# EAGLE design Tractive System Board Rev7 Test (EAGLE 9.6.2)

## Sheet 1 of 3
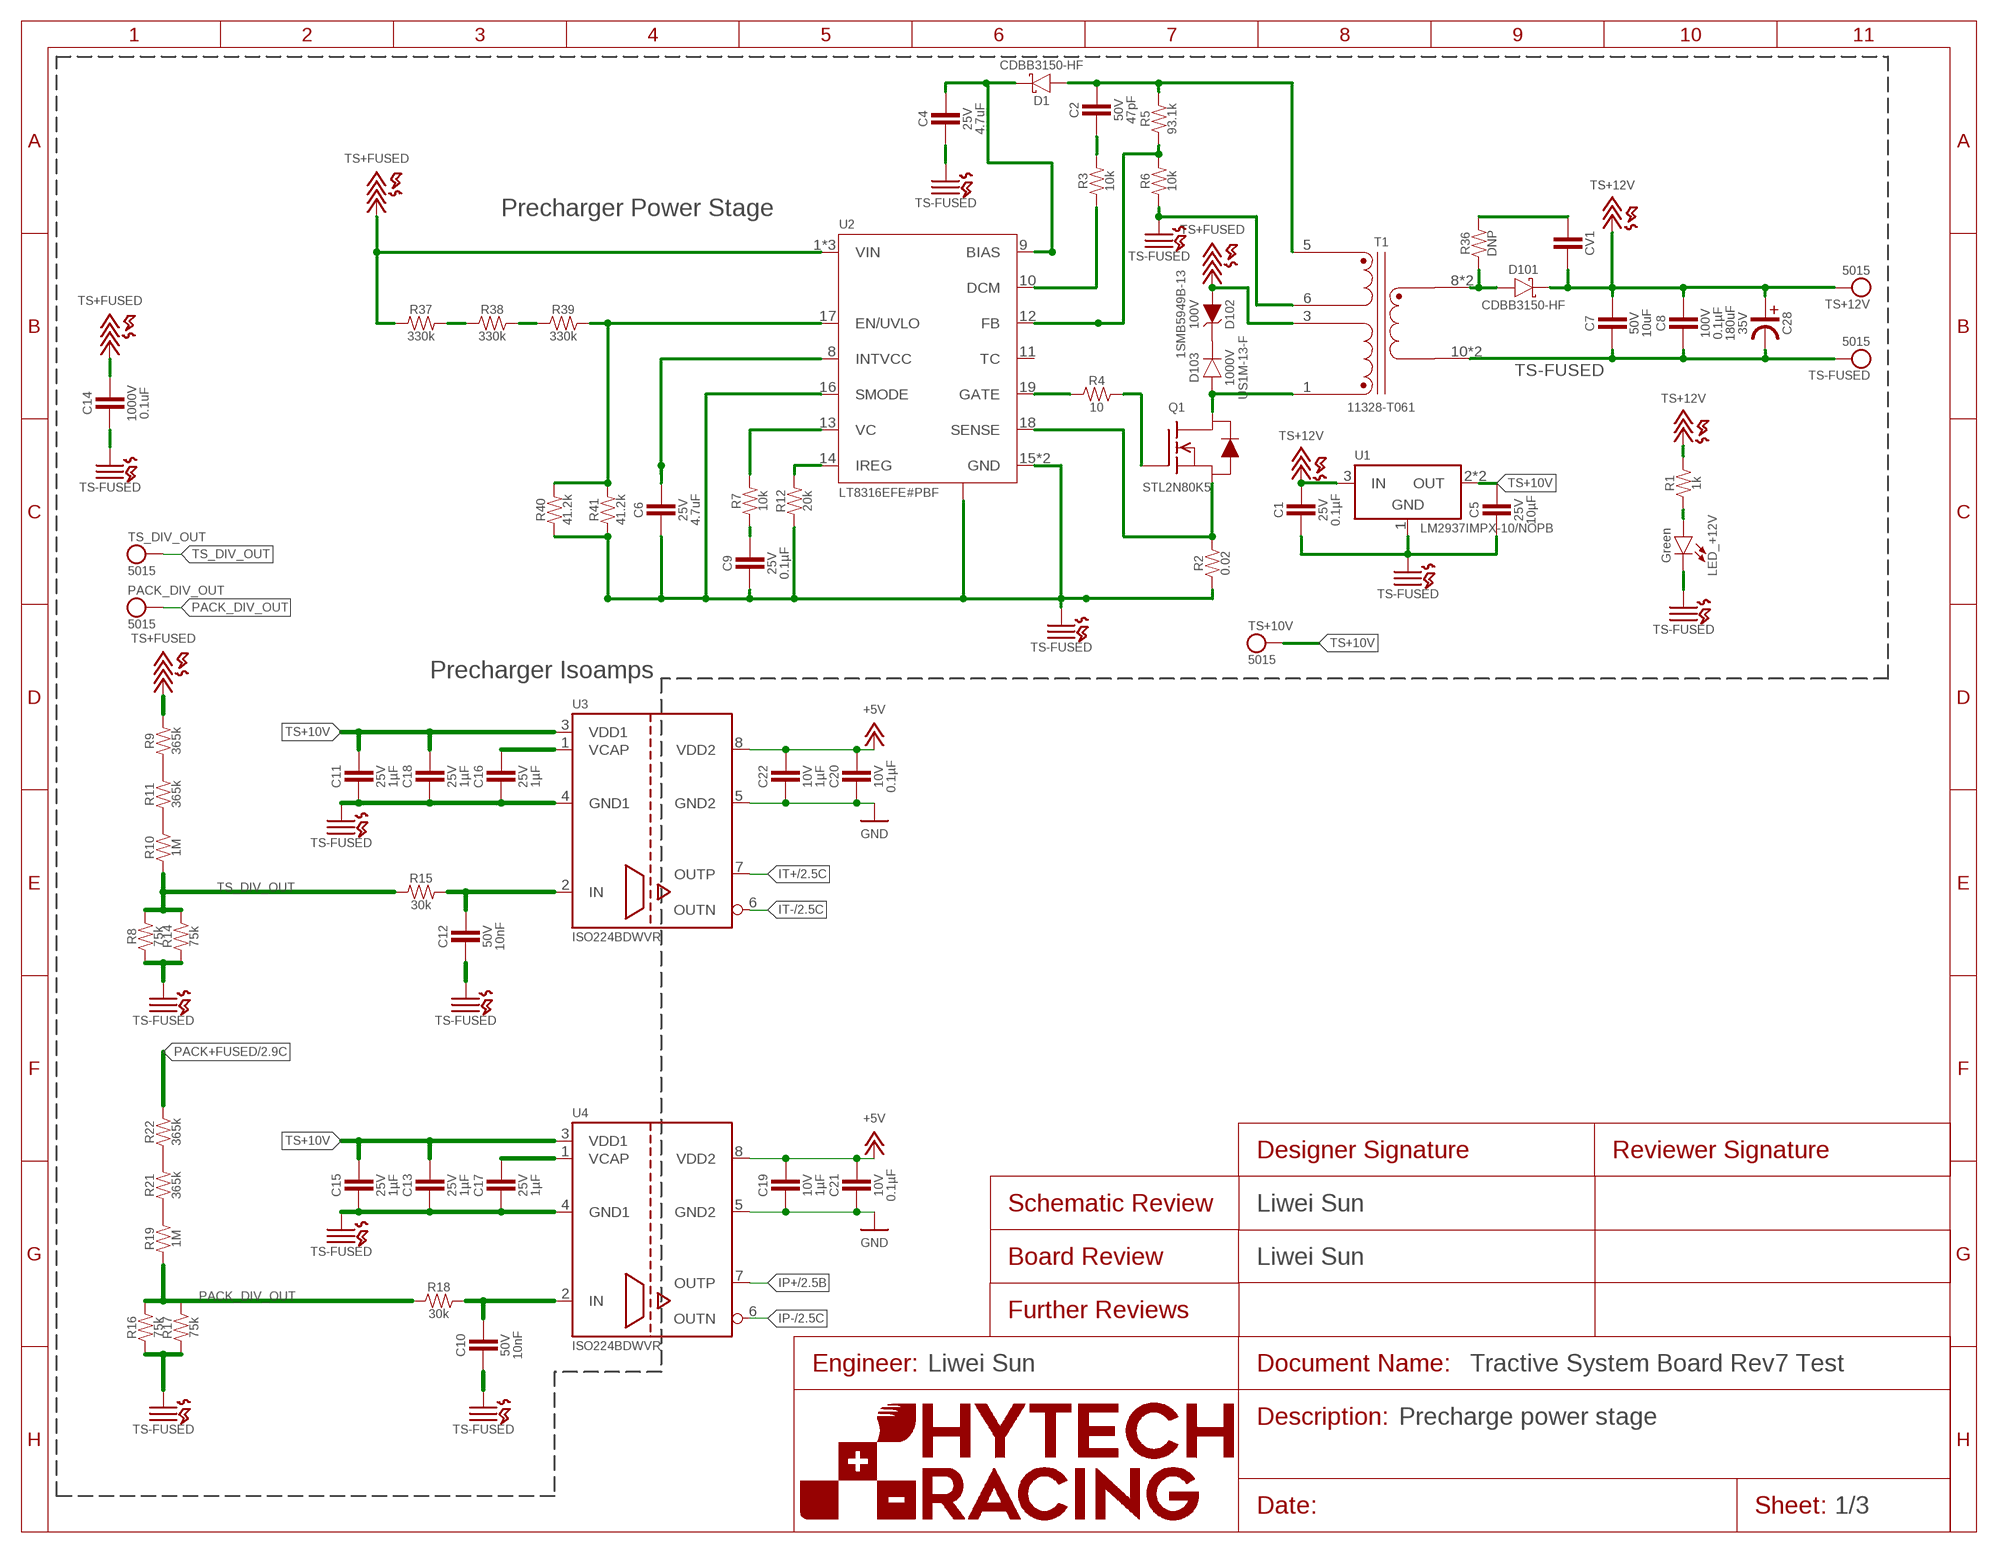
[diagram p0: schematic, sheet 1]
FRAME5 (FRAME): DESCRIPTION_1: Precharge power stage; DESIGNER_BOARD: Liwei Sun; DESIGNER_SCHEMATIC: Liwei Sun; ENGINEER: Liwei Sun

### Parts
C1  CAPACITOR_0603_25V_0.1UF  [0603-CAP]
C2  CAPACITOR_0603_50V_47PF  [0603-CAP]
C4  CAPACITOR_0603_25V_4.7UF  [0603-CAP]
C5  CAPACITOR_0603_25V_10UF  [0603-CAP]
C6  CAPACITOR_0603_25V_4.7UF  [0603-CAP]
C7  CAPACITOR_0805_50V_10UF  [0805-CAP]
C8  CAPACITOR_0603_100V_0.1UF  [0603-CAP]
C9  CAPACITOR_0603_25V_0.1UF  [0603-CAP]
C10  CAPACITOR_0603_50V_10NF  [0603-CAP]
C11  CAPACITOR_0603_25V_1UF  [0603-CAP]
C12  CAPACITOR_0603_50V_10NF  [0603-CAP]
C13  CAPACITOR_0603_25V_1UF  [0603-CAP]
C14  CAPACITOR_1812_1000V_0.1UF  [1812-CAP]
C15  CAPACITOR_0603_25V_1UF  [0603-CAP]
C16  CAPACITOR_0603_25V_1UF  [0603-CAP]
C17  CAPACITOR_0603_25V_1UF  [0603-CAP]
C18  CAPACITOR_0603_25V_1UF  [0603-CAP]
C19  CAPACITOR_0603_10V_1UF  [0603-CAP]
C20  CAPACITOR_0603_10V_0.1UF  [0603-CAP]
C21  CAPACITOR_0603_10V_0.1UF  [0603-CAP]
C22  CAPACITOR_0603_10V_1UF  [0603-CAP]
C28  CAPACITOR_ELECTROLYTIC_A759KR_180UF  [A759KR]
CV1  CAPACITOR_VALUE  [0603-CAP]
D1  SCHOTTKY_DO-214AA_150V  [DO-214AA]
D101  SCHOTTKY_DO-214AA_150V  [DO-214AA]
D102  ZENER_DO-214AA_100V  [DO-214AA]
D103  RECTIFIER_1000V_SMA  [SMA]
LED_+12V  LED_0603_GREEN  [0603-LED]
PACK_DIV_OUT  TEST_POINT  [5015]
Q1  TRANSISTOR_N_MOS_POWERFLAT5X6_STL2N80K5  [POWERFLAT5X6]
R1  RESISTOR_0603_1K  [0603-RES]
R2  RESISTOR_0603_0.02  [0603-RES]
R3  RESISTOR_0603_10K  [0603-RES]
R4  RESISTOR_0603_10  [0603-RES]
R5  RESISTOR_0603_93.1K  [0603-RES]
R6  RESISTOR_0603_10K  [0603-RES]
R7  RESISTOR_0603_10K  [0603-RES]
R8  RESISTOR_0805_HV75K  [0805-RES]
R9  RESISTOR_0805_HV365K  [0805-RES]
R10  RESISTOR_0805_HV1M  [0805-RES]
R11  RESISTOR_0805_HV365K  [0805-RES]
R12  RESISTOR_0603_20K  [0603-RES]
R14  RESISTOR_0805_HV75K  [0805-RES]
R15  RESISTOR_0603_  RESISTOR_0603_30K  [0603-RES]
R16  RESISTOR_0805_HV75K  [0805-RES]
R17  RESISTOR_0805_HV75K  [0805-RES]
R18  RESISTOR_0603_  RESISTOR_0603_30K  [0603-RES]
R19  RESISTOR_0805_HV1M  [0805-RES]
R21  RESISTOR_0805_HV365K  [0805-RES]
R22  RESISTOR_0805_HV365K  [0805-RES]
R36  RESISTOR_0603_DNP  [0603-RES]
R37  RESISTOR_0805_HV330K  [0805-RES]
R38  RESISTOR_0805_HV330K  [0805-RES]
R39  RESISTOR_0805_HV330K  [0805-RES]
R40  RESISTOR_0603_41.2K  [0603-RES]
R41  RESISTOR_0603_41.2K  [0603-RES]
T1  TRANSFORMER(3W)  [PQ2620]
TS+10V  TEST_POINT  [5015]
TS+12V  TEST_POINT  [5015]
TS-FUSED  TEST_POINT  [5015]
TS_DIV_OUT  TEST_POINT  [5015]
U1  VOLTAGE_REGULATOR_SOT-223_10V  [SOT-223]
U2  LT8316  [TSSOP-20(16)]
U3  ISO224B_AIRGAP  [SOIC-08(WIDE,0.295")-AIRGAP]
U4  ISO224B_AIRGAP  [SOIC-08(WIDE,0.295")-AIRGAP]

### Nets
+5V: C19.1 C20.1 C21.1 C22.1 U3.8(VDD2) U4.8(VDD2) ; also sheet 2
GND: C19.2 C20.2 C21.2 C22.2 U3.5(GND2) U4.5(GND2) ; also sheet 2
IP+: U4.7(OUTP) ; also sheet 2
IP-: U4.6(OUTN) ; also sheet 2
IT+: U3.7(OUTP) ; also sheet 2
IT-: U3.6(OUTN) ; also sheet 2
N$1: R21.2 R22.1
N$4: R9.1 R11.2
N$5: D102.2(C) D103.C
N$6: R10.2 R11.1
N$7: R19.2 R21.1
N$8: D103.A Q1.D T1.1
N$9: C4.1 D1.2(C) U2.9(BIAS)
N$12: R5.1 R6.2 U2.12(FB)
N$13: C2.2 R3.2
N$14: R3.1 U2.10(DCM)
N$15: R7.2 U2.13(VC)
N$16: R12.2 U2.14(IREG)
N$17: C2.1 D1.1(A) R5.2 T1.5
N$18: C9.1 R7.1
N$19: C6.1 U2.8(INTVCC)
N$20: R4.1 U2.19(GATE)
N$21: D101.1(A) R36.1 T1.8(8,9) T1.9(8,9)
N$23: LED_+12V.2(A) R1.1
N$26: Q1.S R2.2 U2.18(SENSE)
N$27: Q1.G R4.2
N$28: CV1.2 R36.2
N$29: R37.2 R38.1
N$31: R38.2 R39.1
N$32: R39.2 R40.2 R41.2 U2.17(EN/UVLO)
N$62: C10.1 R18.2 U4.2(IN)
N$63: C12.1 R15.2 U3.2(IN)
N$69: C17.1 U4.1(VCAP)
N$73: C16.1 U3.1(VCAP)
PACK+FUSED: R22.2 ; also sheet 2
PACK_DIV_OUT: PACK_DIV_OUT.1 R16.2 R17.2 R18.1 R19.1
TS+10V: C5.1 C11.1 C13.1 C15.1 C18.1 TS+10V.1 U1.2(OUT) U1.4(OUT) U3.3(VDD1) U4.3(VDD1)
TS+12V: C1.1 C7.1 C8.1 C28.PLUS CV1.1 D101.2(C) R1.2 TS+12V.1 U1.3(IN) ; also sheet 2
TS+FUSED: C14.1 D102.1(A) R9.2 R37.1 T1.3 U2.1(VIN) U2.2(VIN) U2.3(VIN) ; also sheet 2
TS-FUSED: C1.2 C4.2 C5.2 C6.2 C7.2 C8.2 C9.2 C10.2 C11.2 C12.2 C13.2 C14.2 C15.2 C16.2 C17.2 C18.2 C28.MINUS LED_+12V.1(C) R2.1 R6.1 R8.1 R12.1 R14.1 R16.1 R17.1 R40.1 R41.1 T1.6 T1.10(10,11) T1.11(10,11) TS-FUSED.1 U1.1(GND) U2.15(GND) U2.16(SMODE) U2.20(GND) U2.THERMAL U3.4(GND1) U4.4(GND1) ; also sheet 2
TS_DIV_OUT: R8.2 R10.1 R14.2 R15.1 TS_DIV_OUT.1
Unconnected: U2.11(TC)

### Notes on the sheet
- Precharger Power Stage
- Precharger Isoamps

## Sheet 2 of 3
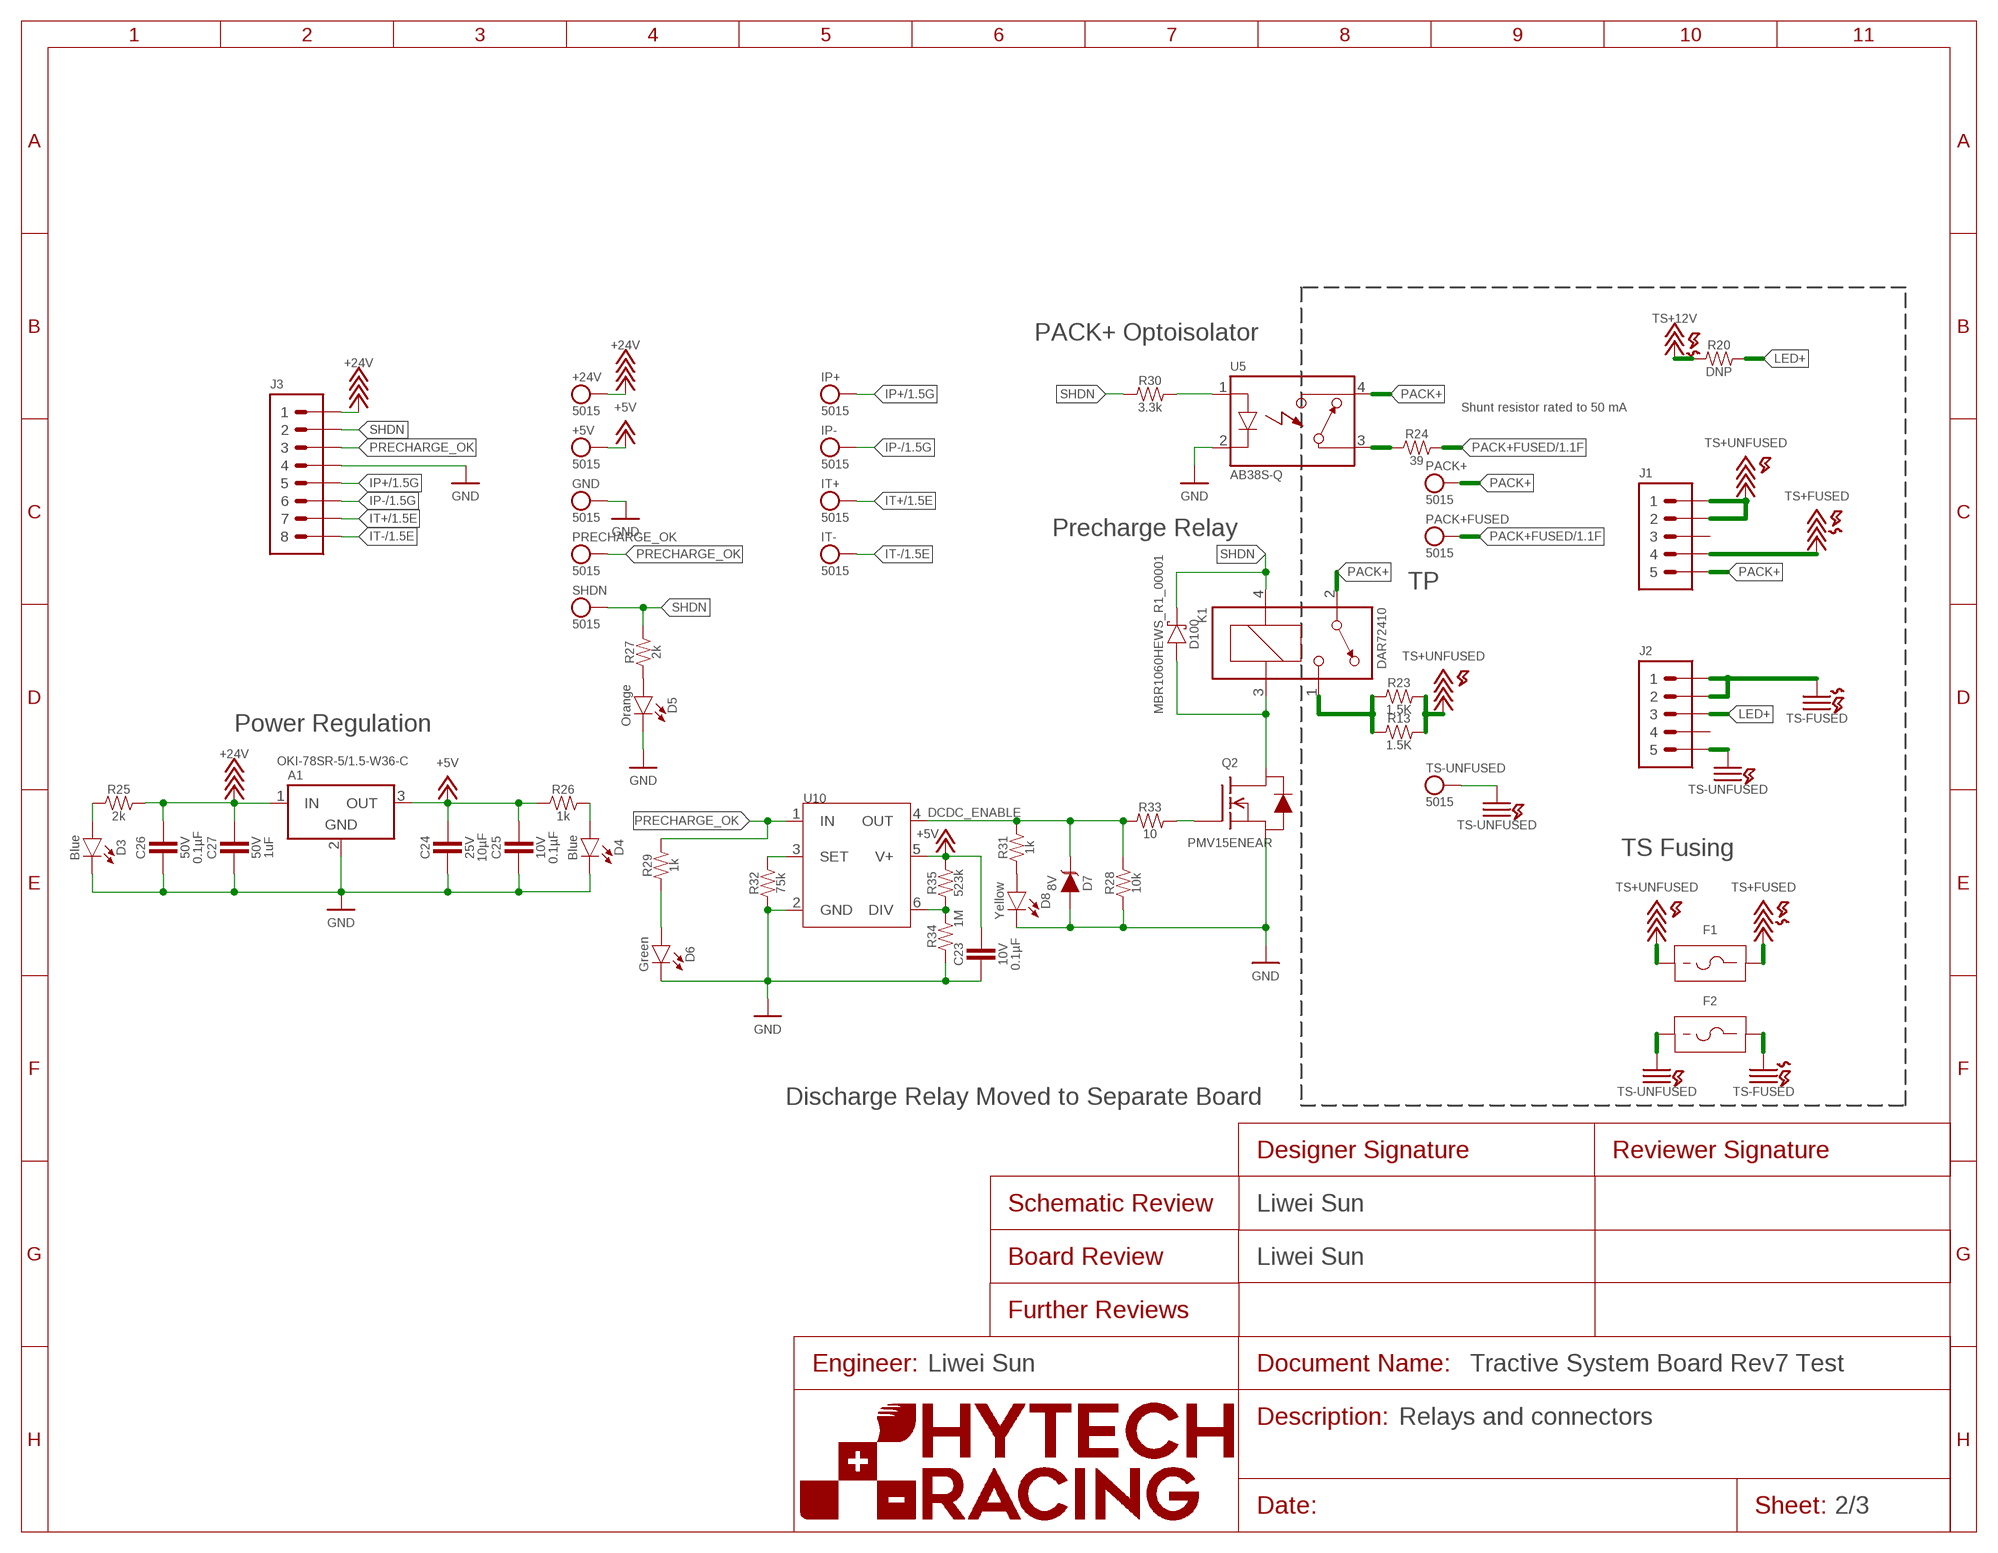
[diagram p1: schematic, sheet 2]
FRAME4 (FRAME): DESCRIPTION_1: Relays and connectors; DESIGNER_BOARD: Liwei Sun; DESIGNER_SCHEMATIC: Liwei Sun; ENGINEER: Liwei Sun

### Parts
+5V  TEST_POINT  [5015]
+24V  TEST_POINT  [5015]
A1  VOLTAGE_REGULATOR_MODULE_OKI-78SR_5V  [OKI-78SR]
C23  CAPACITOR_0603_10V_0.1UF  [0603-CAP]
C24  CAPACITOR_0603_25V_10UF  [0603-CAP]
C25  CAPACITOR_0603_10V_0.1UF  [0603-CAP]
C26  CAPACITOR_0603_50V_0.1UF  [0603-CAP]
C27  CAPACITOR_0603_50V_1UF  [0603-CAP]
D3  LED_0603_BLUE  [0603-LED]
D4  LED_0603_BLUE  [0603-LED]
D5  LED_0603_ORANGE  [0603-LED]
D6  LED_0603_GREEN  [0603-LED]
D7  TVS__8V  [SOT-23]
D8  LED_0603_YELLOW  [0603-LED]
D100  SCHOTTKY_SOD323_60V  [SOD-323]
F1  FUSE_HOLDER_122  [122]
F2  FUSE_HOLDER_122  [122]
GND  TEST_POINT  [5015]
IP+  TEST_POINT  [5015]
IP-  TEST_POINT  [5015]
IT+  TEST_POINT  [5015]
IT-  TEST_POINT  [5015]
J1  CONNECTOR-5_MICRO_V7S_  [MOLEX_MICROFIT_PTH_VERTICAL_07_SINGLE_SPACED]
J2  CONNECTOR-5_MICRO_V6S_  [MOLEX_MICROFIT_PTH_VERTICAL_06_SINGLE_SPACED]
J3  CONNECTOR-8_μF_T_V_BLACK  [MOLEX_MICROFIT_PTH_VERTICAL_08_DUAL]
K1  RELAY_SPST_NO_D_24  [D]
PACK+  TEST_POINT  [5015]
PACK+FUSED  TEST_POINT  [5015]
PRECHARGE_OK  TEST_POINT  [5015]
Q2  TRANSISTOR_N_MOS__PMV15ENEA  [SOT-23]
R13  RESISTOR_B20-SHORTENED_1.5K  [B20-SHORTENED]
R20  RESISTOR_0603_DNP  [0603-RES]
R23  RESISTOR_B20-SHORTENED_1.5K  [B20-SHORTENED]
R24  RESISTOR_0603_39  [0603-RES]
R25  RESISTOR_0603_2K  [0603-RES]
R26  RESISTOR_0603_1K  [0603-RES]
R27  RESISTOR_0603_2K  [0603-RES]
R28  RESISTOR_0603_10K  [0603-RES]
R29  RESISTOR_0603_1K  [0603-RES]
R30  RESISTOR_0603_3.3K  [0603-RES]
R31  RESISTOR_0603_1K  [0603-RES]
R32  RESISTOR_0603_75K  [0603-RES]
R33  RESISTOR_0603_10  [0603-RES]
R34  RESISTOR_0805_1M  [0805-RES]
R35  RESISTOR_0805_523K  [0805-RES]
SHDN  TEST_POINT  [5015]
TS-UNFUSED  TEST_POINT  [5015]
U5  RELAY_SOLIDSTATE_NO_AB38S-Q-AIRGAP  [SOP-04-AIRGAP]
U10  LTC6994-2  [SOT-23-6]

### Nets
+5V: +5V.1 A1.3(OUT) C23.1 C24.1 C25.1 R26.1 R35.2 U10.5(V+) ; also sheet 1
+24V: +24V.1 A1.1(IN) C26.1 C27.1 J3.1 R25.2
DCDC_ENABLE: D7.3(C) R28.2 R31.2 R33.1 U10.4(OUT)
GND: A1.2(GND) C23.2 C24.2 C25.2 C26.2 C27.2 D3.1(C) D4.1(C) D5.1(C) D6.1(C) D7.1(A) D8.1(C) GND.1 J3.4 Q2.2(S) R28.1 R32.1 R34.1 U5.2(CONTROL-) U10.2(GND) ; also sheet 1
IP+: IP+.1 J3.5 ; also sheet 1
IP-: IP-.1 J3.6 ; also sheet 1
IT+: IT+.1 J3.7 ; also sheet 1
IT-: IT-.1 J3.8 ; also sheet 1
LED+: J2.3 R20.2
N$2: D5.2(A) R27.1
N$3: Q2.1(G) R33.2
N$10: R32.2 U10.3(SET)
N$11: R34.2 R35.1 U10.6(DIV)
N$22: D6.2(A) R29.1
N$24: D8.2(A) R31.1
N$25: D3.2(A) R25.1
N$30: D4.2(A) R26.2
N$40: D100.A K1.3(COIL-) Q2.3(D)
N$50: K1.1(CONTACT2) R13.1 R23.1
N$53: R30.2 U5.1(CONTROL+)
N$57: R24.1 U5.3(CONTACT1)
PACK+: J1.5 K1.2(CONTACT1) PACK+.1 U5.4(CONTACT2)
PACK+FUSED: PACK+FUSED.1 R24.2 ; also sheet 1
PRECHARGE_OK: J3.3 PRECHARGE_OK.1 R29.2 U10.1(IN)
SHDN: D100.C J3.2 K1.4(COIL+) R27.2 R30.1 SHDN.1
TS+12V: R20.1 ; also sheet 1
TS+FUSED: F1.3 F1.4 J1.4 ; also sheet 1
TS+UNFUSED: F1.1 F1.2 J1.1 J1.2 R13.2 R23.2
TS-FUSED: F2.3 F2.4 J2.1 J2.2 ; also sheet 1
TS-UNFUSED: F2.1 F2.2 J2.5 TS-UNFUSED.1
Unconnected: J1.3 J2.4

### Notes on the sheet
- PACK+ Optoisolator
- Shunt resistor rated to 50 mA
- Precharge Relay
- TP
- Power Regulation
- TS Fusing
- Discharge Relay Moved to Separate Board

## Sheet 3 of 3
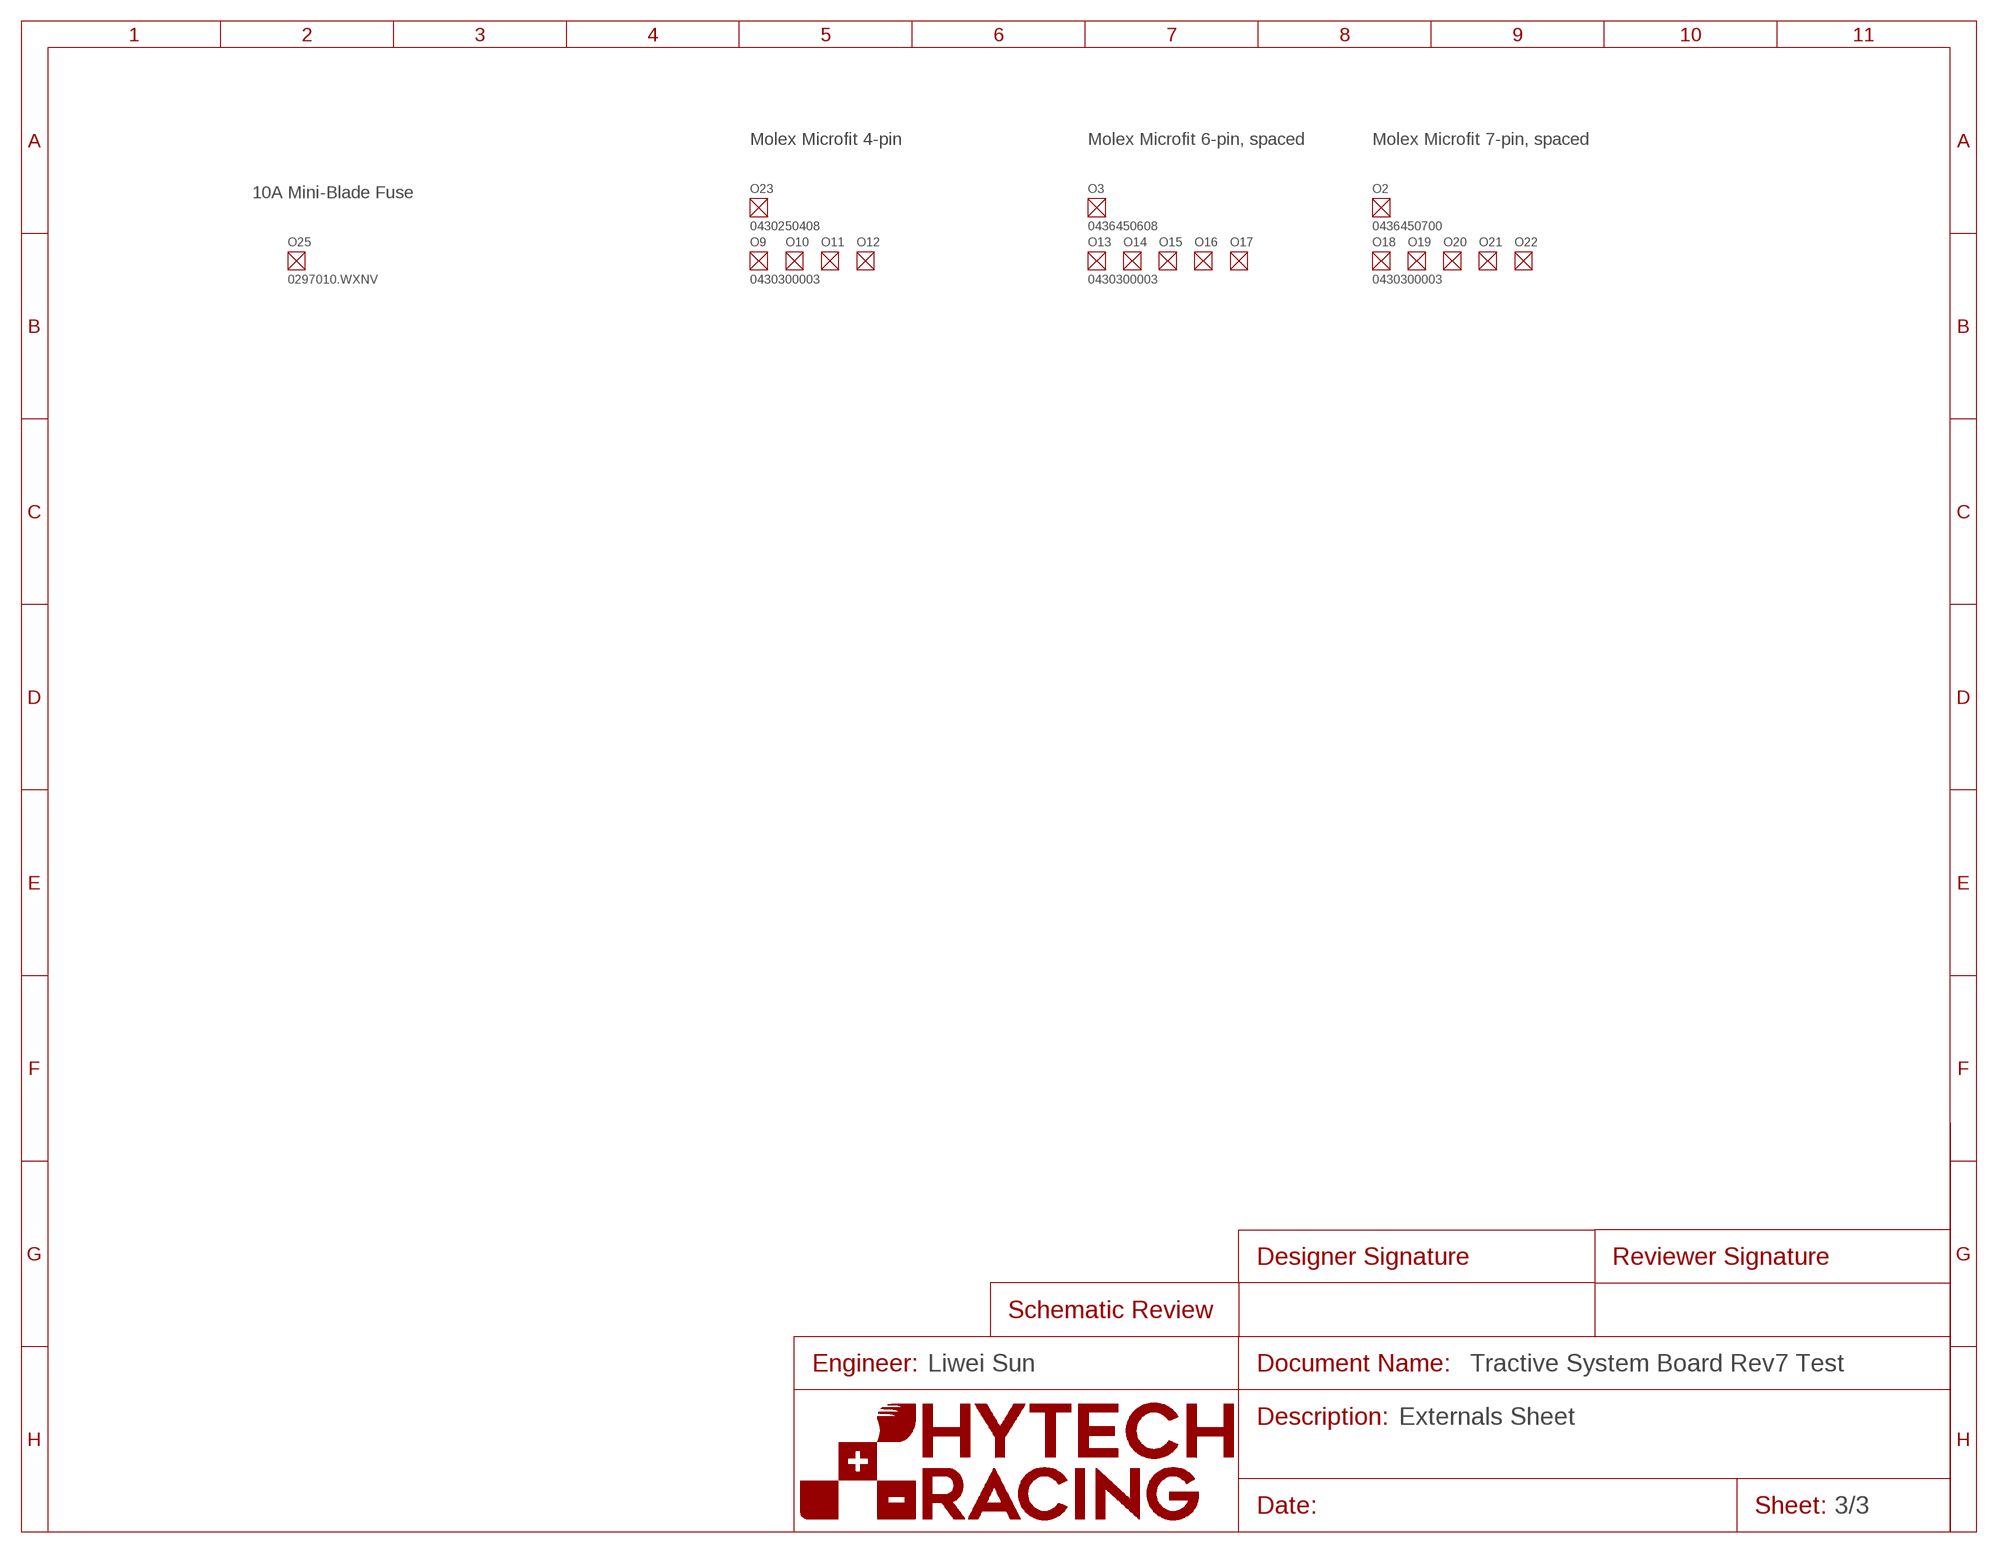
[diagram p2: schematic, sheet 3]
O2 (RECEPTACLE-7_MICROFIT): DKPN: WM2405-ND; MANUFACTURER: Molex; MOPN: 538-43645-0700; MPN: 0436450700
O3 (RECEPTACLE-6_SINGLE_MICROFIT): DKPN: WM13217-ND; MANUFACTURER: Molex; MOPN: 538-43645-0608; MPN: 0436450608
O9 (CRIMP_MICROFIT_20-24): DKPN: WM2776CT-ND; GAUGE: 20-24; MANUFACTURER: Molex; MOPN: 538-43030-0003; MPN: 0430300003
O10 (CRIMP_MICROFIT_20-24): DKPN: WM2776CT-ND; GAUGE: 20-24; MANUFACTURER: Molex; MOPN: 538-43030-0003; MPN: 0430300003
O11 (CRIMP_MICROFIT_20-24): DKPN: WM2776CT-ND; GAUGE: 20-24; MANUFACTURER: Molex; MOPN: 538-43030-0003; MPN: 0430300003
O12 (CRIMP_MICROFIT_20-24): DKPN: WM2776CT-ND; GAUGE: 20-24; MANUFACTURER: Molex; MOPN: 538-43030-0003; MPN: 0430300003
O13 (CRIMP_MICROFIT_20-24): DKPN: WM2776CT-ND; GAUGE: 20-24; MANUFACTURER: Molex; MOPN: 538-43030-0003; MPN: 0430300003
O14 (CRIMP_MICROFIT_20-24): DKPN: WM2776CT-ND; GAUGE: 20-24; MANUFACTURER: Molex; MOPN: 538-43030-0003; MPN: 0430300003
O15 (CRIMP_MICROFIT_20-24): DKPN: WM2776CT-ND; GAUGE: 20-24; MANUFACTURER: Molex; MOPN: 538-43030-0003; MPN: 0430300003
O16 (CRIMP_MICROFIT_20-24): DKPN: WM2776CT-ND; GAUGE: 20-24; MANUFACTURER: Molex; MOPN: 538-43030-0003; MPN: 0430300003
O17 (CRIMP_MICROFIT_20-24): DKPN: WM2776CT-ND; GAUGE: 20-24; MANUFACTURER: Molex; MOPN: 538-43030-0003; MPN: 0430300003
O18 (CRIMP_MICROFIT_20-24): DKPN: WM2776CT-ND; GAUGE: 20-24; MANUFACTURER: Molex; MOPN: 538-43030-0003; MPN: 0430300003
O19 (CRIMP_MICROFIT_20-24): DKPN: WM2776CT-ND; GAUGE: 20-24; MANUFACTURER: Molex; MOPN: 538-43030-0003; MPN: 0430300003
O20 (CRIMP_MICROFIT_20-24): DKPN: WM2776CT-ND; GAUGE: 20-24; MANUFACTURER: Molex; MOPN: 538-43030-0003; MPN: 0430300003
O21 (CRIMP_MICROFIT_20-24): DKPN: WM2776CT-ND; GAUGE: 20-24; MANUFACTURER: Molex; MOPN: 538-43030-0003; MPN: 0430300003
O22 (CRIMP_MICROFIT_20-24): DKPN: WM2776CT-ND; GAUGE: 20-24; MANUFACTURER: Molex; MOPN: 538-43030-0003; MPN: 0430300003
O23 (RECEPTACLE-4_MICROFIT): DKPN: WM11225-ND; MANUFACTURER: Molex; MOPN: 538-43025-0408; MPN: 0430250408
O25 (FUSE_MINI_BLADE_10): DKPN: F991-ND; MANUFACTURER: Littelfuse; MOPN: 576-0297010.WXNV; MPN: 0297010.WXNV
U$49 (FRAME_SCHEMATIC_ONLY): DESCRIPTION_1: Externals Sheet; ENGINEER: Liwei Sun

### Notes on the sheet
- Molex Microfit 4-pin | Molex Microfit 6-pin, spaced | Molex Microfit 7-pin, spaced
- 10A Mini-Blade Fuse

## Library data of the parts
+5V +24V GND IP+ IP- IT+ IT- PACK+ PACK+FUSED PACK_DIV_OUT PRECHARGE_OK SHDN TS+10V TS+12V TS-FUSED TS-UNFUSED TS_DIV_OUT = HyTechDevices:TEST_POINT: Test Point for Probing; DKPN: 36-5015CT-ND; MANUFACTURER: Keystone Electronics; MOPN: 534-5015; MPN: 5015
A1 = HyTechDevices:VOLTAGE_REGULATOR_MODULE_?_*: Voltage Regulator Modules OKI-78SR Datasheet <https://www.mouser.com/datasheet/2/281/oki-78sr-56393.pdf>; DKPN: 811-2196-5-ND; MANUFACTURER: Murata Power Solutions Inc.; MOPN: 580-OKI78SR5/1.5W36C; MPN: OKI-78SR-5/1.5-W36-C
C1 C9 = HyTechDevices:CAPACITOR_?_*: Capacitor, Non-Polarized VJ...1BC Series Datasheet <https://www.mouser.com/datasheet/2/427/vjw1bcbascomseries-1762447.pdf> Samsung Datasheet <https://www.mouser.com/datasheet/2/585/MLCC-1837944.pdf> Walsin Datasheet <https://www.mouser.com/datasheet/2/210/WTC_MLCC_General_Purpose-1534899.pdf> GRM188R61A226ME15D <https://www.mouser.com/datasheet/2/281/1/GRM188R61A226ME15_02A-1985787.pdf> GRM188R61E106MA73D <https://www.mouser.com/datasheet/2/281/1/GRM188R61E106MA73_01A-1985806.pdf> 885012006013 <https://www.mouser.com/datasheet/2/445/885012006013-1726946.pdf> 2220Y6300105KXTWS2 <https://www.mouser.com/datasheet/2/218/SMD_High_and_Std_StackiCap_P62-1825512.pdf> Yageo Class 2, X5R <https://www.mouser.com/datasheet/2/447/UPY_GPHC_X5R_4V_to_50V_26-1827097.pdf> TDK C Series <https://www.mouser.com/ProductDetail/TDK/C3216X5R1V226M160AC?qs=%2Fha2pyFadujbcx9jh7lYl%2F4NeMoXFhdc8AqVWNq4wW6M2y7zl6GzBuhgtI0ngznN> AVX Automotive MLCC <https://www.mouser.com/datasheet/2/40/AutoMLCC-777028.pdf> KEMET X7R Series <https://www.mouser.com/datasheet/2/212/KEM_C1002_X7R_SMD-1102033.pdf> Kyocera AVX <https://www.mouser.com/datasheet/2/40/C0GNP0_Dielectric-951274.pdf> GRM21BR61H <https://www.mouser.com/datasheet/2/281/1/GRM21BR61H106KE43_01A-1986884.pdf> C1812W104KDRACTU <https://www.mouser.com/datasheet/2/212/KEM_C1034_X7R_HV_ARC_SMD-1101730.pdf>; CAPACITANCE: 0.1µF; DKPN: 1276-1006-1-ND; MANUFACTURER: Samsung Electro-Mechanics; MOPN: 187-CL10B104KA8NNNC; MPN: CL10B104KA8NNNC; TOLERANCE: 10%; VOLTAGE: 25V
C2 = HyTechDevices:CAPACITOR_?_*: Capacitor, Non-Polarized VJ...1BC Series Datasheet <https://www.mouser.com/datasheet/2/427/vjw1bcbascomseries-1762447.pdf> Samsung Datasheet <https://www.mouser.com/datasheet/2/585/MLCC-1837944.pdf> Walsin Datasheet <https://www.mouser.com/datasheet/2/210/WTC_MLCC_General_Purpose-1534899.pdf> GRM188R61A226ME15D <https://www.mouser.com/datasheet/2/281/1/GRM188R61A226ME15_02A-1985787.pdf> GRM188R61E106MA73D <https://www.mouser.com/datasheet/2/281/1/GRM188R61E106MA73_01A-1985806.pdf> 885012006013 <https://www.mouser.com/datasheet/2/445/885012006013-1726946.pdf> 2220Y6300105KXTWS2 <https://www.mouser.com/datasheet/2/218/SMD_High_and_Std_StackiCap_P62-1825512.pdf> Yageo Class 2, X5R <https://www.mouser.com/datasheet/2/447/UPY_GPHC_X5R_4V_to_50V_26-1827097.pdf> TDK C Series <https://www.mouser.com/ProductDetail/TDK/C3216X5R1V226M160AC?qs=%2Fha2pyFadujbcx9jh7lYl%2F4NeMoXFhdc8AqVWNq4wW6M2y7zl6GzBuhgtI0ngznN> AVX Automotive MLCC <https://www.mouser.com/datasheet/2/40/AutoMLCC-777028.pdf> KEMET X7R Series <https://www.mouser.com/datasheet/2/212/KEM_C1002_X7R_SMD-1102033.pdf> Kyocera AVX <https://www.mouser.com/datasheet/2/40/C0GNP0_Dielectric-951274.pdf> GRM21BR61H <https://www.mouser.com/datasheet/2/281/1/GRM21BR61H106KE43_01A-1986884.pdf> C1812W104KDRACTU <https://www.mouser.com/datasheet/2/212/KEM_C1034_X7R_HV_ARC_SMD-1101730.pdf>; CAPACITANCE: 47pF; DKPN: 445-12417-1-ND; MANUFACTURER: TDK Corporation; MOPN: CGA3E2NP01H470J080AA; MPN: CGA3E2NP01H470J080AA; TOLERANCE: 5%; VOLTAGE: 50V
C4 C6 = HyTechDevices:CAPACITOR_?_*: Capacitor, Non-Polarized VJ...1BC Series Datasheet <https://www.mouser.com/datasheet/2/427/vjw1bcbascomseries-1762447.pdf> Samsung Datasheet <https://www.mouser.com/datasheet/2/585/MLCC-1837944.pdf> Walsin Datasheet <https://www.mouser.com/datasheet/2/210/WTC_MLCC_General_Purpose-1534899.pdf> GRM188R61A226ME15D <https://www.mouser.com/datasheet/2/281/1/GRM188R61A226ME15_02A-1985787.pdf> GRM188R61E106MA73D <https://www.mouser.com/datasheet/2/281/1/GRM188R61E106MA73_01A-1985806.pdf> 885012006013 <https://www.mouser.com/datasheet/2/445/885012006013-1726946.pdf> 2220Y6300105KXTWS2 <https://www.mouser.com/datasheet/2/218/SMD_High_and_Std_StackiCap_P62-1825512.pdf> Yageo Class 2, X5R <https://www.mouser.com/datasheet/2/447/UPY_GPHC_X5R_4V_to_50V_26-1827097.pdf> TDK C Series <https://www.mouser.com/ProductDetail/TDK/C3216X5R1V226M160AC?qs=%2Fha2pyFadujbcx9jh7lYl%2F4NeMoXFhdc8AqVWNq4wW6M2y7zl6GzBuhgtI0ngznN> AVX Automotive MLCC <https://www.mouser.com/datasheet/2/40/AutoMLCC-777028.pdf> KEMET X7R Series <https://www.mouser.com/datasheet/2/212/KEM_C1002_X7R_SMD-1102033.pdf> Kyocera AVX <https://www.mouser.com/datasheet/2/40/C0GNP0_Dielectric-951274.pdf> GRM21BR61H <https://www.mouser.com/datasheet/2/281/1/GRM21BR61H106KE43_01A-1986884.pdf> C1812W104KDRACTU <https://www.mouser.com/datasheet/2/212/KEM_C1034_X7R_HV_ARC_SMD-1101730.pdf>; CAPACITANCE: 4.7uF; DKPN: 445-9050-1-ND; MANUFACTURER: TDK Corporation; MOPN: 810-C1608X5R1E475K; MPN: C1608X5R1E475K080AC; TOLERANCE: 10%; VOLTAGE: 25V
C5 C24 = HyTechDevices:CAPACITOR_?_*: Capacitor, Non-Polarized VJ...1BC Series Datasheet <https://www.mouser.com/datasheet/2/427/vjw1bcbascomseries-1762447.pdf> Samsung Datasheet <https://www.mouser.com/datasheet/2/585/MLCC-1837944.pdf> Walsin Datasheet <https://www.mouser.com/datasheet/2/210/WTC_MLCC_General_Purpose-1534899.pdf> GRM188R61A226ME15D <https://www.mouser.com/datasheet/2/281/1/GRM188R61A226ME15_02A-1985787.pdf> GRM188R61E106MA73D <https://www.mouser.com/datasheet/2/281/1/GRM188R61E106MA73_01A-1985806.pdf> 885012006013 <https://www.mouser.com/datasheet/2/445/885012006013-1726946.pdf> 2220Y6300105KXTWS2 <https://www.mouser.com/datasheet/2/218/SMD_High_and_Std_StackiCap_P62-1825512.pdf> Yageo Class 2, X5R <https://www.mouser.com/datasheet/2/447/UPY_GPHC_X5R_4V_to_50V_26-1827097.pdf> TDK C Series <https://www.mouser.com/ProductDetail/TDK/C3216X5R1V226M160AC?qs=%2Fha2pyFadujbcx9jh7lYl%2F4NeMoXFhdc8AqVWNq4wW6M2y7zl6GzBuhgtI0ngznN> AVX Automotive MLCC <https://www.mouser.com/datasheet/2/40/AutoMLCC-777028.pdf> KEMET X7R Series <https://www.mouser.com/datasheet/2/212/KEM_C1002_X7R_SMD-1102033.pdf> Kyocera AVX <https://www.mouser.com/datasheet/2/40/C0GNP0_Dielectric-951274.pdf> GRM21BR61H <https://www.mouser.com/datasheet/2/281/1/GRM21BR61H106KE43_01A-1986884.pdf> C1812W104KDRACTU <https://www.mouser.com/datasheet/2/212/KEM_C1034_X7R_HV_ARC_SMD-1101730.pdf>; CAPACITANCE: 10µF; DKPN: 490-7202-1-ND; MANUFACTURER: Murata Electronics; MOPN: 81-GRM188R61E106MA3D; MPN: GRM188R61E106MA73D; TOLERANCE: 20%; VOLTAGE: 25V
C7 = HyTechDevices:CAPACITOR_?_*: Capacitor, Non-Polarized VJ...1BC Series Datasheet <https://www.mouser.com/datasheet/2/427/vjw1bcbascomseries-1762447.pdf> Samsung Datasheet <https://www.mouser.com/datasheet/2/585/MLCC-1837944.pdf> Walsin Datasheet <https://www.mouser.com/datasheet/2/210/WTC_MLCC_General_Purpose-1534899.pdf> GRM188R61A226ME15D <https://www.mouser.com/datasheet/2/281/1/GRM188R61A226ME15_02A-1985787.pdf> GRM188R61E106MA73D <https://www.mouser.com/datasheet/2/281/1/GRM188R61E106MA73_01A-1985806.pdf> 885012006013 <https://www.mouser.com/datasheet/2/445/885012006013-1726946.pdf> 2220Y6300105KXTWS2 <https://www.mouser.com/datasheet/2/218/SMD_High_and_Std_StackiCap_P62-1825512.pdf> Yageo Class 2, X5R <https://www.mouser.com/datasheet/2/447/UPY_GPHC_X5R_4V_to_50V_26-1827097.pdf> TDK C Series <https://www.mouser.com/ProductDetail/TDK/C3216X5R1V226M160AC?qs=%2Fha2pyFadujbcx9jh7lYl%2F4NeMoXFhdc8AqVWNq4wW6M2y7zl6GzBuhgtI0ngznN> AVX Automotive MLCC <https://www.mouser.com/datasheet/2/40/AutoMLCC-777028.pdf> KEMET X7R Series <https://www.mouser.com/datasheet/2/212/KEM_C1002_X7R_SMD-1102033.pdf> Kyocera AVX <https://www.mouser.com/datasheet/2/40/C0GNP0_Dielectric-951274.pdf> GRM21BR61H <https://www.mouser.com/datasheet/2/281/1/GRM21BR61H106KE43_01A-1986884.pdf> C1812W104KDRACTU <https://www.mouser.com/datasheet/2/212/KEM_C1034_X7R_HV_ARC_SMD-1101730.pdf>; CAPACITANCE: 10uF; DKPN: 490-18663-2-ND; MANUFACTURER: Murata; MOPN: 81-GRM21BR61H106KE3L; MPN: GRM21BR61H106KE43L; TOLERANCE: 10%; VOLTAGE: 50V
C8 = HyTechDevices:CAPACITOR_?_*: Capacitor, Non-Polarized VJ...1BC Series Datasheet <https://www.mouser.com/datasheet/2/427/vjw1bcbascomseries-1762447.pdf> Samsung Datasheet <https://www.mouser.com/datasheet/2/585/MLCC-1837944.pdf> Walsin Datasheet <https://www.mouser.com/datasheet/2/210/WTC_MLCC_General_Purpose-1534899.pdf> GRM188R61A226ME15D <https://www.mouser.com/datasheet/2/281/1/GRM188R61A226ME15_02A-1985787.pdf> GRM188R61E106MA73D <https://www.mouser.com/datasheet/2/281/1/GRM188R61E106MA73_01A-1985806.pdf> 885012006013 <https://www.mouser.com/datasheet/2/445/885012006013-1726946.pdf> 2220Y6300105KXTWS2 <https://www.mouser.com/datasheet/2/218/SMD_High_and_Std_StackiCap_P62-1825512.pdf> Yageo Class 2, X5R <https://www.mouser.com/datasheet/2/447/UPY_GPHC_X5R_4V_to_50V_26-1827097.pdf> TDK C Series <https://www.mouser.com/ProductDetail/TDK/C3216X5R1V226M160AC?qs=%2Fha2pyFadujbcx9jh7lYl%2F4NeMoXFhdc8AqVWNq4wW6M2y7zl6GzBuhgtI0ngznN> AVX Automotive MLCC <https://www.mouser.com/datasheet/2/40/AutoMLCC-777028.pdf> KEMET X7R Series <https://www.mouser.com/datasheet/2/212/KEM_C1002_X7R_SMD-1102033.pdf> Kyocera AVX <https://www.mouser.com/datasheet/2/40/C0GNP0_Dielectric-951274.pdf> GRM21BR61H <https://www.mouser.com/datasheet/2/281/1/GRM21BR61H106KE43_01A-1986884.pdf> C1812W104KDRACTU <https://www.mouser.com/datasheet/2/212/KEM_C1034_X7R_HV_ARC_SMD-1101730.pdf>; CAPACITANCE: 0.1µF; DKPN: 311-1523-1-ND; MANUFACTURER: Yageo; MOPN: 603-CC603KRX7R0BB104; MPN: CC0603KRX7R0BB104; TOLERANCE: 10%; VOLTAGE: 100V
C10 C12 = HyTechDevices:CAPACITOR_?_*: Capacitor, Non-Polarized VJ...1BC Series Datasheet <https://www.mouser.com/datasheet/2/427/vjw1bcbascomseries-1762447.pdf> Samsung Datasheet <https://www.mouser.com/datasheet/2/585/MLCC-1837944.pdf> Walsin Datasheet <https://www.mouser.com/datasheet/2/210/WTC_MLCC_General_Purpose-1534899.pdf> GRM188R61A226ME15D <https://www.mouser.com/datasheet/2/281/1/GRM188R61A226ME15_02A-1985787.pdf> GRM188R61E106MA73D <https://www.mouser.com/datasheet/2/281/1/GRM188R61E106MA73_01A-1985806.pdf> 885012006013 <https://www.mouser.com/datasheet/2/445/885012006013-1726946.pdf> 2220Y6300105KXTWS2 <https://www.mouser.com/datasheet/2/218/SMD_High_and_Std_StackiCap_P62-1825512.pdf> Yageo Class 2, X5R <https://www.mouser.com/datasheet/2/447/UPY_GPHC_X5R_4V_to_50V_26-1827097.pdf> TDK C Series <https://www.mouser.com/ProductDetail/TDK/C3216X5R1V226M160AC?qs=%2Fha2pyFadujbcx9jh7lYl%2F4NeMoXFhdc8AqVWNq4wW6M2y7zl6GzBuhgtI0ngznN> AVX Automotive MLCC <https://www.mouser.com/datasheet/2/40/AutoMLCC-777028.pdf> KEMET X7R Series <https://www.mouser.com/datasheet/2/212/KEM_C1002_X7R_SMD-1102033.pdf> Kyocera AVX <https://www.mouser.com/datasheet/2/40/C0GNP0_Dielectric-951274.pdf> GRM21BR61H <https://www.mouser.com/datasheet/2/281/1/GRM21BR61H106KE43_01A-1986884.pdf> C1812W104KDRACTU <https://www.mouser.com/datasheet/2/212/KEM_C1034_X7R_HV_ARC_SMD-1101730.pdf>; CAPACITANCE: 10nF; DKPN: 445-7404-1-ND; MANUFACTURER: TDK Corporation; MOPN: 810-C1608C0G1H103J; MPN: C1608C0G1H103J080AA; TOLERANCE: 5%; VOLTAGE: 50V
C11 C13 C15-C18 = HyTechDevices:CAPACITOR_?_*: Capacitor, Non-Polarized VJ...1BC Series Datasheet <https://www.mouser.com/datasheet/2/427/vjw1bcbascomseries-1762447.pdf> Samsung Datasheet <https://www.mouser.com/datasheet/2/585/MLCC-1837944.pdf> Walsin Datasheet <https://www.mouser.com/datasheet/2/210/WTC_MLCC_General_Purpose-1534899.pdf> GRM188R61A226ME15D <https://www.mouser.com/datasheet/2/281/1/GRM188R61A226ME15_02A-1985787.pdf> GRM188R61E106MA73D <https://www.mouser.com/datasheet/2/281/1/GRM188R61E106MA73_01A-1985806.pdf> 885012006013 <https://www.mouser.com/datasheet/2/445/885012006013-1726946.pdf> 2220Y6300105KXTWS2 <https://www.mouser.com/datasheet/2/218/SMD_High_and_Std_StackiCap_P62-1825512.pdf> Yageo Class 2, X5R <https://www.mouser.com/datasheet/2/447/UPY_GPHC_X5R_4V_to_50V_26-1827097.pdf> TDK C Series <https://www.mouser.com/ProductDetail/TDK/C3216X5R1V226M160AC?qs=%2Fha2pyFadujbcx9jh7lYl%2F4NeMoXFhdc8AqVWNq4wW6M2y7zl6GzBuhgtI0ngznN> AVX Automotive MLCC <https://www.mouser.com/datasheet/2/40/AutoMLCC-777028.pdf> KEMET X7R Series <https://www.mouser.com/datasheet/2/212/KEM_C1002_X7R_SMD-1102033.pdf> Kyocera AVX <https://www.mouser.com/datasheet/2/40/C0GNP0_Dielectric-951274.pdf> GRM21BR61H <https://www.mouser.com/datasheet/2/281/1/GRM21BR61H106KE43_01A-1986884.pdf> C1812W104KDRACTU <https://www.mouser.com/datasheet/2/212/KEM_C1034_X7R_HV_ARC_SMD-1101730.pdf>; CAPACITANCE: 1µF; DKPN: 1276-1184-1-ND; MANUFACTURER: Samsung Electro-Mechanics; MOPN: 187-CL10B105KA8NNNC; MPN: CL10B105KA8NNNC; TOLERANCE: 10%; VOLTAGE: 25V
C14 = HyTechDevices:CAPACITOR_?_*: Capacitor, Non-Polarized VJ...1BC Series Datasheet <https://www.mouser.com/datasheet/2/427/vjw1bcbascomseries-1762447.pdf> Samsung Datasheet <https://www.mouser.com/datasheet/2/585/MLCC-1837944.pdf> Walsin Datasheet <https://www.mouser.com/datasheet/2/210/WTC_MLCC_General_Purpose-1534899.pdf> GRM188R61A226ME15D <https://www.mouser.com/datasheet/2/281/1/GRM188R61A226ME15_02A-1985787.pdf> GRM188R61E106MA73D <https://www.mouser.com/datasheet/2/281/1/GRM188R61E106MA73_01A-1985806.pdf> 885012006013 <https://www.mouser.com/datasheet/2/445/885012006013-1726946.pdf> 2220Y6300105KXTWS2 <https://www.mouser.com/datasheet/2/218/SMD_High_and_Std_StackiCap_P62-1825512.pdf> Yageo Class 2, X5R <https://www.mouser.com/datasheet/2/447/UPY_GPHC_X5R_4V_to_50V_26-1827097.pdf> TDK C Series <https://www.mouser.com/ProductDetail/TDK/C3216X5R1V226M160AC?qs=%2Fha2pyFadujbcx9jh7lYl%2F4NeMoXFhdc8AqVWNq4wW6M2y7zl6GzBuhgtI0ngznN> AVX Automotive MLCC <https://www.mouser.com/datasheet/2/40/AutoMLCC-777028.pdf> KEMET X7R Series <https://www.mouser.com/datasheet/2/212/KEM_C1002_X7R_SMD-1102033.pdf> Kyocera AVX <https://www.mouser.com/datasheet/2/40/C0GNP0_Dielectric-951274.pdf> GRM21BR61H <https://www.mouser.com/datasheet/2/281/1/GRM21BR61H106KE43_01A-1986884.pdf> C1812W104KDRACTU <https://www.mouser.com/datasheet/2/212/KEM_C1034_X7R_HV_ARC_SMD-1101730.pdf>; CAPACITANCE: 0.1uF; DKPN: 399-C1812W104KDRAC7800CT-ND; MANUFACTURER: KEMET; MOPN: 80-C1812W104KDR; MPN: C1812W104KDRAC7800; TOLERANCE: 10%; VOLTAGE: 1000V
C19 C22 = HyTechDevices:CAPACITOR_?_*: Capacitor, Non-Polarized VJ...1BC Series Datasheet <https://www.mouser.com/datasheet/2/427/vjw1bcbascomseries-1762447.pdf> Samsung Datasheet <https://www.mouser.com/datasheet/2/585/MLCC-1837944.pdf> Walsin Datasheet <https://www.mouser.com/datasheet/2/210/WTC_MLCC_General_Purpose-1534899.pdf> GRM188R61A226ME15D <https://www.mouser.com/datasheet/2/281/1/GRM188R61A226ME15_02A-1985787.pdf> GRM188R61E106MA73D <https://www.mouser.com/datasheet/2/281/1/GRM188R61E106MA73_01A-1985806.pdf> 885012006013 <https://www.mouser.com/datasheet/2/445/885012006013-1726946.pdf> 2220Y6300105KXTWS2 <https://www.mouser.com/datasheet/2/218/SMD_High_and_Std_StackiCap_P62-1825512.pdf> Yageo Class 2, X5R <https://www.mouser.com/datasheet/2/447/UPY_GPHC_X5R_4V_to_50V_26-1827097.pdf> TDK C Series <https://www.mouser.com/ProductDetail/TDK/C3216X5R1V226M160AC?qs=%2Fha2pyFadujbcx9jh7lYl%2F4NeMoXFhdc8AqVWNq4wW6M2y7zl6GzBuhgtI0ngznN> AVX Automotive MLCC <https://www.mouser.com/datasheet/2/40/AutoMLCC-777028.pdf> KEMET X7R Series <https://www.mouser.com/datasheet/2/212/KEM_C1002_X7R_SMD-1102033.pdf> Kyocera AVX <https://www.mouser.com/datasheet/2/40/C0GNP0_Dielectric-951274.pdf> GRM21BR61H <https://www.mouser.com/datasheet/2/281/1/GRM21BR61H106KE43_01A-1986884.pdf> C1812W104KDRACTU <https://www.mouser.com/datasheet/2/212/KEM_C1034_X7R_HV_ARC_SMD-1101730.pdf>; CAPACITANCE: 1µF; DKPN: 311-1796-1-ND; MANUFACTURER: Yageo; MOPN: 603-CC603KRX7R6BB105; MPN: CC0603KRX7R6BB105; TOLERANCE: 10%; VOLTAGE: 10V
C20 C21 C23 C25 = HyTechDevices:CAPACITOR_?_*: Capacitor, Non-Polarized VJ...1BC Series Datasheet <https://www.mouser.com/datasheet/2/427/vjw1bcbascomseries-1762447.pdf> Samsung Datasheet <https://www.mouser.com/datasheet/2/585/MLCC-1837944.pdf> Walsin Datasheet <https://www.mouser.com/datasheet/2/210/WTC_MLCC_General_Purpose-1534899.pdf> GRM188R61A226ME15D <https://www.mouser.com/datasheet/2/281/1/GRM188R61A226ME15_02A-1985787.pdf> GRM188R61E106MA73D <https://www.mouser.com/datasheet/2/281/1/GRM188R61E106MA73_01A-1985806.pdf> 885012006013 <https://www.mouser.com/datasheet/2/445/885012006013-1726946.pdf> 2220Y6300105KXTWS2 <https://www.mouser.com/datasheet/2/218/SMD_High_and_Std_StackiCap_P62-1825512.pdf> Yageo Class 2, X5R <https://www.mouser.com/datasheet/2/447/UPY_GPHC_X5R_4V_to_50V_26-1827097.pdf> TDK C Series <https://www.mouser.com/ProductDetail/TDK/C3216X5R1V226M160AC?qs=%2Fha2pyFadujbcx9jh7lYl%2F4NeMoXFhdc8AqVWNq4wW6M2y7zl6GzBuhgtI0ngznN> AVX Automotive MLCC <https://www.mouser.com/datasheet/2/40/AutoMLCC-777028.pdf> KEMET X7R Series <https://www.mouser.com/datasheet/2/212/KEM_C1002_X7R_SMD-1102033.pdf> Kyocera AVX <https://www.mouser.com/datasheet/2/40/C0GNP0_Dielectric-951274.pdf> GRM21BR61H <https://www.mouser.com/datasheet/2/281/1/GRM21BR61H106KE43_01A-1986884.pdf> C1812W104KDRACTU <https://www.mouser.com/datasheet/2/212/KEM_C1034_X7R_HV_ARC_SMD-1101730.pdf>; CAPACITANCE: 0.1µF; DKPN: 720-1688-1-ND; MANUFACTURER: Vishay Vitramon; MOPN: 77-VJ0603Y104JXQPBC; MPN: VJ0603Y104JXQPW1BC; TOLERANCE: 5%; VOLTAGE: 10V
C26 = HyTechDevices:CAPACITOR_?_*: Capacitor, Non-Polarized VJ...1BC Series Datasheet <https://www.mouser.com/datasheet/2/427/vjw1bcbascomseries-1762447.pdf> Samsung Datasheet <https://www.mouser.com/datasheet/2/585/MLCC-1837944.pdf> Walsin Datasheet <https://www.mouser.com/datasheet/2/210/WTC_MLCC_General_Purpose-1534899.pdf> GRM188R61A226ME15D <https://www.mouser.com/datasheet/2/281/1/GRM188R61A226ME15_02A-1985787.pdf> GRM188R61E106MA73D <https://www.mouser.com/datasheet/2/281/1/GRM188R61E106MA73_01A-1985806.pdf> 885012006013 <https://www.mouser.com/datasheet/2/445/885012006013-1726946.pdf> 2220Y6300105KXTWS2 <https://www.mouser.com/datasheet/2/218/SMD_High_and_Std_StackiCap_P62-1825512.pdf> Yageo Class 2, X5R <https://www.mouser.com/datasheet/2/447/UPY_GPHC_X5R_4V_to_50V_26-1827097.pdf> TDK C Series <https://www.mouser.com/ProductDetail/TDK/C3216X5R1V226M160AC?qs=%2Fha2pyFadujbcx9jh7lYl%2F4NeMoXFhdc8AqVWNq4wW6M2y7zl6GzBuhgtI0ngznN> AVX Automotive MLCC <https://www.mouser.com/datasheet/2/40/AutoMLCC-777028.pdf> KEMET X7R Series <https://www.mouser.com/datasheet/2/212/KEM_C1002_X7R_SMD-1102033.pdf> Kyocera AVX <https://www.mouser.com/datasheet/2/40/C0GNP0_Dielectric-951274.pdf> GRM21BR61H <https://www.mouser.com/datasheet/2/281/1/GRM21BR61H106KE43_01A-1986884.pdf> C1812W104KDRACTU <https://www.mouser.com/datasheet/2/212/KEM_C1034_X7R_HV_ARC_SMD-1101730.pdf>; CAPACITANCE: 0.1µF; DKPN: 311-1344-1-ND; MANUFACTURER: Yageo; MOPN: 603-CC603KRX7R9BB104; MPN: CC0603KRX7R9BB104; TOLERANCE: 10%; VOLTAGE: 50V
C27 = HyTechDevices:CAPACITOR_?_*: Capacitor, Non-Polarized VJ...1BC Series Datasheet <https://www.mouser.com/datasheet/2/427/vjw1bcbascomseries-1762447.pdf> Samsung Datasheet <https://www.mouser.com/datasheet/2/585/MLCC-1837944.pdf> Walsin Datasheet <https://www.mouser.com/datasheet/2/210/WTC_MLCC_General_Purpose-1534899.pdf> GRM188R61A226ME15D <https://www.mouser.com/datasheet/2/281/1/GRM188R61A226ME15_02A-1985787.pdf> GRM188R61E106MA73D <https://www.mouser.com/datasheet/2/281/1/GRM188R61E106MA73_01A-1985806.pdf> 885012006013 <https://www.mouser.com/datasheet/2/445/885012006013-1726946.pdf> 2220Y6300105KXTWS2 <https://www.mouser.com/datasheet/2/218/SMD_High_and_Std_StackiCap_P62-1825512.pdf> Yageo Class 2, X5R <https://www.mouser.com/datasheet/2/447/UPY_GPHC_X5R_4V_to_50V_26-1827097.pdf> TDK C Series <https://www.mouser.com/ProductDetail/TDK/C3216X5R1V226M160AC?qs=%2Fha2pyFadujbcx9jh7lYl%2F4NeMoXFhdc8AqVWNq4wW6M2y7zl6GzBuhgtI0ngznN> AVX Automotive MLCC <https://www.mouser.com/datasheet/2/40/AutoMLCC-777028.pdf> KEMET X7R Series <https://www.mouser.com/datasheet/2/212/KEM_C1002_X7R_SMD-1102033.pdf> Kyocera AVX <https://www.mouser.com/datasheet/2/40/C0GNP0_Dielectric-951274.pdf> GRM21BR61H <https://www.mouser.com/datasheet/2/281/1/GRM21BR61H106KE43_01A-1986884.pdf> C1812W104KDRACTU <https://www.mouser.com/datasheet/2/212/KEM_C1034_X7R_HV_ARC_SMD-1101730.pdf>; CAPACITANCE: 1uF; DKPN: 587-2400-2-ND; MANUFACTURER: Taiyo Yuden; MOPN: 963-UMK107BJ105KA-T; MPN: UMK107BJ105KA-T; TOLERANCE: 10%; VOLTAGE: 50V
C28 = HyTechDevices:CAPACITOR_ELECTROLYTIC_?_*: A759 Series Aluminium Hybrid Electrolytic Capacitor Datasheet <https://www.mouser.com/datasheet/2/212/KEM_A4072_A759-1104329.pdf> EEH_AZS Hybrid Electrolytic Capacitor Datasheet <https://www.mouser.com/datasheet/2/315/DMD0000COL92-1141863.pdf> EEU-FP1E Aluminum Electrolytic Capacitor Datasheet <https://www.mouser.com/datasheet/2/315/RDF0000C1260-1391675.pdf>; CAPACITANCE: 180uF; DKPN: 399-A759KR187M1VAAE024-ND; ESR: 24mOhms; MANUFACTURER: KEMET; MOPN: 80-A759KR187M1VAAE24; MPN: A759KR187M1VAAE024; TOLERANCE: 20%; VOLTAGE: 35V
CV1 = HyTechDevices:CAPACITOR_VALUE: Capacitor for prototyping circuits
D1 D101 = HyTechDevices:SCHOTTKY_?_*: CUS08F30 Shottky Diode Datasheet <https://www.mouser.com/datasheet/2/408/CUS08F30_datasheet_en_20140414-1916097.pdf>; CURRENT: 3A; DKPN: 641-1720-1-ND; MANUFACTURER: Comchip Technology; MOPN: 750-CDBB3150-HF; MPN: CDBB3150-HF; VOLTAGE: 150V
D3 D4 = HyTechDevices:LED_?_*: LED 0603 Blue <https://www.mouser.com/datasheet/2/216/APT1608VBC_D-246010.pdf> Green <https://www.mouser.com/datasheet/2/216/APT1608ZGCK-1173388.pdf> Orange <https://www.mouser.com/datasheet/2/216/APT1608SECK-6197.pdf> Red <https://www.mouser.com/datasheet/2/216/APT1608SECK-J3-PRV-1173336.pdf> White <https://www.mouser.com/datasheet/2/50/SM0603UWC-880813.pdf> Yellow <https://www.mouser.com/datasheet/2/216/APT1608SYCK-J3-PRV-1173311.pdf> 2835 (Series not on Digikey) Lumiled LUXEON 2835 Color Line <https://www.mouser.com/datasheet/2/602/DS236_luxeon_2835_color_line_datasheet-1596094.pdf>; COLOR: Blue; DKPN: 754-1789-1-ND; MANUFACTURER: Kingbright; MOPN: 604-APT1608VBC/D; MPN: APT1608VBC/D
D5 = HyTechDevices:LED_?_*: LED 0603 Blue <https://www.mouser.com/datasheet/2/216/APT1608VBC_D-246010.pdf> Green <https://www.mouser.com/datasheet/2/216/APT1608ZGCK-1173388.pdf> Orange <https://www.mouser.com/datasheet/2/216/APT1608SECK-6197.pdf> Red <https://www.mouser.com/datasheet/2/216/APT1608SECK-J3-PRV-1173336.pdf> White <https://www.mouser.com/datasheet/2/50/SM0603UWC-880813.pdf> Yellow <https://www.mouser.com/datasheet/2/216/APT1608SYCK-J3-PRV-1173311.pdf> 2835 (Series not on Digikey) Lumiled LUXEON 2835 Color Line <https://www.mouser.com/datasheet/2/602/DS236_luxeon_2835_color_line_datasheet-1596094.pdf>; COLOR: Orange; DKPN: 754-1120-1-ND; MANUFACTURER: Kingbright; MOPN: 604-APT1608SECK; MPN: APT1608SECK
D6 LED_+12V = HyTechDevices:LED_?_*: LED 0603 Blue <https://www.mouser.com/datasheet/2/216/APT1608VBC_D-246010.pdf> Green <https://www.mouser.com/datasheet/2/216/APT1608ZGCK-1173388.pdf> Orange <https://www.mouser.com/datasheet/2/216/APT1608SECK-6197.pdf> Red <https://www.mouser.com/datasheet/2/216/APT1608SECK-J3-PRV-1173336.pdf> White <https://www.mouser.com/datasheet/2/50/SM0603UWC-880813.pdf> Yellow <https://www.mouser.com/datasheet/2/216/APT1608SYCK-J3-PRV-1173311.pdf> 2835 (Series not on Digikey) Lumiled LUXEON 2835 Color Line <https://www.mouser.com/datasheet/2/602/DS236_luxeon_2835_color_line_datasheet-1596094.pdf>; COLOR: Green; DKPN: 754-1790-1-ND; MANUFACTURER: Kingbright; MOPN: 604-APT1608ZGCK; MPN: APT1608ZGCK
D7 = HyTechDevices:TVS_?_*: TVS Diode GSOT Datasheet <https://www.mouser.com/datasheet/2/427/gsot03-1767593.pdf>; DKPN: GSOT08-E3-08TR-ND; MANUFACTURER: Vishay General Semiconductor - Diodes Division; MOPN: 78-GSOT08-E3-08; MPN: GSOT08-E3-08; VOLTAGE: 8V
D8 = HyTechDevices:LED_?_*: LED 0603 Blue <https://www.mouser.com/datasheet/2/216/APT1608VBC_D-246010.pdf> Green <https://www.mouser.com/datasheet/2/216/APT1608ZGCK-1173388.pdf> Orange <https://www.mouser.com/datasheet/2/216/APT1608SECK-6197.pdf> Red <https://www.mouser.com/datasheet/2/216/APT1608SECK-J3-PRV-1173336.pdf> White <https://www.mouser.com/datasheet/2/50/SM0603UWC-880813.pdf> Yellow <https://www.mouser.com/datasheet/2/216/APT1608SYCK-J3-PRV-1173311.pdf> 2835 (Series not on Digikey) Lumiled LUXEON 2835 Color Line <https://www.mouser.com/datasheet/2/602/DS236_luxeon_2835_color_line_datasheet-1596094.pdf>; COLOR: Yellow; DKPN: 754-1788-1-ND; MANUFACTURER: Kingbright; MOPN: 604-APT1608SYCK/J3-PRV; MPN: APT1608SYCK/J3-PRV
D100 = HyTechDevices:SCHOTTKY_?_*: CUS08F30 Shottky Diode Datasheet <https://www.mouser.com/datasheet/2/408/CUS08F30_datasheet_en_20140414-1916097.pdf>; CURRENT: 1A; DKPN: 3757-MBR1060HEWS_R1_00001TR-ND; MANUFACTURER: Panjit International Inc.; MOPN: 241-MBR1060HEWSR1000; MPN: MBR1060HEWS_R1_00001; VOLTAGE: 60V
D102 = HyTechDevices:ZENER_?_*: Zener Diode 1SMB5949B-13 <https://www.diodes.com/assets/Datasheets/ds32125.pdf>; CURRENT: 0.03A; DKPN: 1SMB5949B-13DICT-ND; MANUFACTURER: Diodes Incorporated; MOPN: 621-1SMB5949B-13; MPN: 1SMB5949B-13; VOLTAGE: 100V
D103 = HyTechDevices:RECTIFIER_*_?: Diodes Incorporated US1GWF Datasheet <https://www.mouser.com/datasheet/2/115/DIOD_S_A0003383552_1-2542294.pdf> Diodes Incorporated US1M Datasheet <https://www.diodes.com/assets/Datasheets/ds16008.pdf>; CURRENT: 1A; DKPN: US1M-FDITR-ND; MANUFACTURER: Diodes Incorporated; MOPN: 621-US1M-F; MPN: US1M-13-F; VOLTAGE: 1000V
F1 F2 = HyTechDevices:FUSE_HOLDER_*: Fuse Holder All PNs for the holder; if Miniblade Fuses <https://www.littelfuse.com/media?resourcetype=datasheets&itemid=0f5f58cb-559e-494b-8d53-723f30445ae5&filename=littelfuse-mini-datasheet> needed, order separately. Mini-Blade PTH <https://www.mouser.com/datasheet/2/215/3568-742601.pdf> Mini-Blade SMD <https://www.mouser.com/datasheet/2/215/588-744913.pdf> Littelfuse 122 Fuse Holder and Fuse Fuse <https://www.littelfuse.com/~/media/electronics/datasheets/fuses/littelfuse_fuse_508_datasheet.pdf.pdf> Fuse Holder <https://www.littelfuse.com/~/media/electronics/datasheets/fuse_clips/littelfuse_fuse_clip_102_122_datasheet.pdf.pdf>; DKPN: F3783-ND; FUSE_TYPE: 1 1/4" Cartridge; MANUFACTURER: Littelfuse; MOPN: 576-01220088Z; MPN: 01220088Z
J1 = HyTechDevices:CONNECTOR-5_?_*; MANUFACTURER: Molex; MPN: 2165713007
J2 = HyTechDevices:CONNECTOR-5_?_*; MANUFACTURER: Molex; MPN: 2165713006
J3 = HyTechDevices:CONNECTOR-8_?_*: 8 Pin Connector; DKPN: WM1798-ND; MANUFACTURER: Molex; MOPN: 538-43045-0814; MPN: 430450814
K1 = HyTechDevices:RELAY_SPST_NO_?*: Single Pole, Single Throw Relay Normally Open 355x Series <https://www.comus-intl.com/wp-content/uploads/2017/01/High-Voltage-Reed-Relays.pdf> D Series <https://www.mouser.com/datasheet/2/657/cynergy3_d_pcb_v2-1892244.pdf>; DKPN: 725-1048-ND; MANUFACTURER: Sensata-Cynergy3; MOPN: 285-DAR72410; MPN: DAR72410
Q1 = HyTechDevices:TRANSISTOR_N_MOS_?_*: N-MOSFET PMV15ENEA Datasheet <https://www.mouser.com/datasheet/2/916/PMV15ENEA-1604828.pdf> TK6P65W Datasheet <https://www.mouser.com/datasheet/2/408/TK6P65W_datasheet_en_20151225-1916290.pdf> SIR638ADP Datasheet <https://www.mouser.com/datasheet/2/427/sir638adp-1766131.pdf> DMG3406L Datasheet <https://www.diodes.com/assets/Datasheets/DMG3406L.pdf> STL2N80K5 <https://www.mouser.com/datasheet/2/389/dm00092662-1798082.pdf>; DKPN: 497-14539-1-ND; MANUFACTURER: STMicroelectronics; MOPN: 511-STL2N80K5; MPN: STL2N80K5
Q2 = HyTechDevices:TRANSISTOR_N_MOS_?_*: N-MOSFET PMV15ENEA Datasheet <https://www.mouser.com/datasheet/2/916/PMV15ENEA-1604828.pdf> TK6P65W Datasheet <https://www.mouser.com/datasheet/2/408/TK6P65W_datasheet_en_20151225-1916290.pdf> SIR638ADP Datasheet <https://www.mouser.com/datasheet/2/427/sir638adp-1766131.pdf> DMG3406L Datasheet <https://www.diodes.com/assets/Datasheets/DMG3406L.pdf> STL2N80K5 <https://www.mouser.com/datasheet/2/389/dm00092662-1798082.pdf>; DKPN: 1727-8588-1-ND; MANUFACTURER: Nexperia USA Inc.; MOPN: 771-PMV15ENEAR; MPN: PMV15ENEAR
R1 R26 R29 R31 = HyTechDevices:RESISTOR_?_*: Resistor PWR163 Series <https://www.mouser.com/datasheet/2/54/pwr163-777985.pdf> AC Series <https://www.mouser.com/datasheet/2/447/Yageo_PYu_AC_51_RoHS_L_7_1714230-1874691.pdf> PU Series <https://www.mouser.com/datasheet/2/447/PYu-PU_51_RoHS_L_6-1504619.pdf> ERA Series <https://www.mouser.com/datasheet/2/315/AOA0000C307-1149632.pdf> PWR263 Series <https://www.mouser.com/datasheet/2/54/pwr263s_35-778069.pdf> KTR Series <https://www.mouser.com/datasheet/2/348/ROHM_S_A0011075115_1-2563276.pdf> RC Series <https://www.mouser.com/datasheet/2/447/Yageo_03_18_2021_PYu_RC_Group_51_RoHS_L_11-2199992.pdf> ERJ PB3, PB6 Series <https://www.mouser.com/datasheet/2/315/AOA0000C328-1530132.pdf> ERJ PA2, P03, PA3, P06, P08, P14 Series <https://www.mouser.com/datasheet/2/315/AOA0000C331-1141874.pdf> B20 Series <https://www.ohmite.com/assets/docs/res_200.pdf?r=false> TE Connectivity/Holsworthy RN73 Series <https://www.mouser.com/datasheet/2/418/4/NG_DS_1773270_M-604713.pdf> Vishay Dale D/CRCW e3 <https://www.mouser.com/datasheet/2/427/dcrcwe3-1762152.pdf> Ohmite B20 <https://www.ohmite.com/assets/docs/res_200.pdf?r=false>; DKPN: 1712-CPF-A-0603B1K0ETR-ND; MANUFACTURER: TE Connectivity Passive Product; MOPN: 279-CPF-A-0603B1K0E; MPN: CPF-A-0603B1K0E; POWER: 0.0625W; RESISTANCE: 1k; TOLERANCE: 0.1%; VOLTAGE_CONTINUOUS: 7.9V; VOLTAGE_MAX: 50V
R2 = HyTechDevices:RESISTOR_?_*: Resistor PWR163 Series <https://www.mouser.com/datasheet/2/54/pwr163-777985.pdf> AC Series <https://www.mouser.com/datasheet/2/447/Yageo_PYu_AC_51_RoHS_L_7_1714230-1874691.pdf> PU Series <https://www.mouser.com/datasheet/2/447/PYu-PU_51_RoHS_L_6-1504619.pdf> ERA Series <https://www.mouser.com/datasheet/2/315/AOA0000C307-1149632.pdf> PWR263 Series <https://www.mouser.com/datasheet/2/54/pwr263s_35-778069.pdf> KTR Series <https://www.mouser.com/datasheet/2/348/ROHM_S_A0011075115_1-2563276.pdf> RC Series <https://www.mouser.com/datasheet/2/447/Yageo_03_18_2021_PYu_RC_Group_51_RoHS_L_11-2199992.pdf> ERJ PB3, PB6 Series <https://www.mouser.com/datasheet/2/315/AOA0000C328-1530132.pdf> ERJ PA2, P03, PA3, P06, P08, P14 Series <https://www.mouser.com/datasheet/2/315/AOA0000C331-1141874.pdf> B20 Series <https://www.ohmite.com/assets/docs/res_200.pdf?r=false> TE Connectivity/Holsworthy RN73 Series <https://www.mouser.com/datasheet/2/418/4/NG_DS_1773270_M-604713.pdf> Vishay Dale D/CRCW e3 <https://www.mouser.com/datasheet/2/427/dcrcwe3-1762152.pdf> Ohmite B20 <https://www.ohmite.com/assets/docs/res_200.pdf?r=false>; DKPN: P17461CT-ND; MANUFACTURER: Panasonic Electronic Components; MOPN: 667-ERJ-3BWFR020V; MPN: ERJ-3BWFR020V; POWER: 0.33W; RESISTANCE: 0.02; TOLERANCE: 1%; VOLTAGE_CONTINUOUS: 0.081V; VOLTAGE_MAX: 150V
R3 R6 R7 R28 = HyTechDevices:RESISTOR_?_*: Resistor PWR163 Series <https://www.mouser.com/datasheet/2/54/pwr163-777985.pdf> AC Series <https://www.mouser.com/datasheet/2/447/Yageo_PYu_AC_51_RoHS_L_7_1714230-1874691.pdf> PU Series <https://www.mouser.com/datasheet/2/447/PYu-PU_51_RoHS_L_6-1504619.pdf> ERA Series <https://www.mouser.com/datasheet/2/315/AOA0000C307-1149632.pdf> PWR263 Series <https://www.mouser.com/datasheet/2/54/pwr263s_35-778069.pdf> KTR Series <https://www.mouser.com/datasheet/2/348/ROHM_S_A0011075115_1-2563276.pdf> RC Series <https://www.mouser.com/datasheet/2/447/Yageo_03_18_2021_PYu_RC_Group_51_RoHS_L_11-2199992.pdf> ERJ PB3, PB6 Series <https://www.mouser.com/datasheet/2/315/AOA0000C328-1530132.pdf> ERJ PA2, P03, PA3, P06, P08, P14 Series <https://www.mouser.com/datasheet/2/315/AOA0000C331-1141874.pdf> B20 Series <https://www.ohmite.com/assets/docs/res_200.pdf?r=false> TE Connectivity/Holsworthy RN73 Series <https://www.mouser.com/datasheet/2/418/4/NG_DS_1773270_M-604713.pdf> Vishay Dale D/CRCW e3 <https://www.mouser.com/datasheet/2/427/dcrcwe3-1762152.pdf> Ohmite B20 <https://www.ohmite.com/assets/docs/res_200.pdf?r=false>; DKPN: P10KBDCT-ND; MANUFACTURER: Panasonic Electronic Components; MOPN: 667-ERA-3ARB103V; MPN: ERA-3ARB103V; POWER: 0.1W; RESISTANCE: 10k; TOLERANCE: 0.1%; VOLTAGE_CONTINUOUS: 31.62V; VOLTAGE_MAX: 75V
R4 R33 = HyTechDevices:RESISTOR_?_*: Resistor PWR163 Series <https://www.mouser.com/datasheet/2/54/pwr163-777985.pdf> AC Series <https://www.mouser.com/datasheet/2/447/Yageo_PYu_AC_51_RoHS_L_7_1714230-1874691.pdf> PU Series <https://www.mouser.com/datasheet/2/447/PYu-PU_51_RoHS_L_6-1504619.pdf> ERA Series <https://www.mouser.com/datasheet/2/315/AOA0000C307-1149632.pdf> PWR263 Series <https://www.mouser.com/datasheet/2/54/pwr263s_35-778069.pdf> KTR Series <https://www.mouser.com/datasheet/2/348/ROHM_S_A0011075115_1-2563276.pdf> RC Series <https://www.mouser.com/datasheet/2/447/Yageo_03_18_2021_PYu_RC_Group_51_RoHS_L_11-2199992.pdf> ERJ PB3, PB6 Series <https://www.mouser.com/datasheet/2/315/AOA0000C328-1530132.pdf> ERJ PA2, P03, PA3, P06, P08, P14 Series <https://www.mouser.com/datasheet/2/315/AOA0000C331-1141874.pdf> B20 Series <https://www.ohmite.com/assets/docs/res_200.pdf?r=false> TE Connectivity/Holsworthy RN73 Series <https://www.mouser.com/datasheet/2/418/4/NG_DS_1773270_M-604713.pdf> Vishay Dale D/CRCW e3 <https://www.mouser.com/datasheet/2/427/dcrcwe3-1762152.pdf> Ohmite B20 <https://www.ohmite.com/assets/docs/res_200.pdf?r=false>; DKPN: 311-10.0HRCT-ND; MANUFACTURER: Yageo; MOPN: 603-RC0603FR-0710RL; MPN: RC0603FR-0710RL; POWER: 0.1W; RESISTANCE: 10; TOLERANCE: 1%; VOLTAGE_CONTINUOUS: 1.00V; VOLTAGE_MAX: 75V
R5 = HyTechDevices:RESISTOR_?_*: Resistor PWR163 Series <https://www.mouser.com/datasheet/2/54/pwr163-777985.pdf> AC Series <https://www.mouser.com/datasheet/2/447/Yageo_PYu_AC_51_RoHS_L_7_1714230-1874691.pdf> PU Series <https://www.mouser.com/datasheet/2/447/PYu-PU_51_RoHS_L_6-1504619.pdf> ERA Series <https://www.mouser.com/datasheet/2/315/AOA0000C307-1149632.pdf> PWR263 Series <https://www.mouser.com/datasheet/2/54/pwr263s_35-778069.pdf> KTR Series <https://www.mouser.com/datasheet/2/348/ROHM_S_A0011075115_1-2563276.pdf> RC Series <https://www.mouser.com/datasheet/2/447/Yageo_03_18_2021_PYu_RC_Group_51_RoHS_L_11-2199992.pdf> ERJ PB3, PB6 Series <https://www.mouser.com/datasheet/2/315/AOA0000C328-1530132.pdf> ERJ PA2, P03, PA3, P06, P08, P14 Series <https://www.mouser.com/datasheet/2/315/AOA0000C331-1141874.pdf> B20 Series <https://www.ohmite.com/assets/docs/res_200.pdf?r=false> TE Connectivity/Holsworthy RN73 Series <https://www.mouser.com/datasheet/2/418/4/NG_DS_1773270_M-604713.pdf> Vishay Dale D/CRCW e3 <https://www.mouser.com/datasheet/2/427/dcrcwe3-1762152.pdf> Ohmite B20 <https://www.ohmite.com/assets/docs/res_200.pdf?r=false>; DKPN: P20197CT-ND; MANUFACTURER: Panasonic Electronic Components; MOPN: 667-ERJ-PB3B9312V; MPN: ERJ-PB3B9312V; POWER: 0.2W; RESISTANCE: 93.1k; TOLERANCE: 0.1%; VOLTAGE_CONTINUOUS: 136V; VOLTAGE_MAX: 150V
R8 R14 R16 R17 = HyTechDevices:RESISTOR_?_*: Resistor PWR163 Series <https://www.mouser.com/datasheet/2/54/pwr163-777985.pdf> AC Series <https://www.mouser.com/datasheet/2/447/Yageo_PYu_AC_51_RoHS_L_7_1714230-1874691.pdf> PU Series <https://www.mouser.com/datasheet/2/447/PYu-PU_51_RoHS_L_6-1504619.pdf> ERA Series <https://www.mouser.com/datasheet/2/315/AOA0000C307-1149632.pdf> PWR263 Series <https://www.mouser.com/datasheet/2/54/pwr263s_35-778069.pdf> KTR Series <https://www.mouser.com/datasheet/2/348/ROHM_S_A0011075115_1-2563276.pdf> RC Series <https://www.mouser.com/datasheet/2/447/Yageo_03_18_2021_PYu_RC_Group_51_RoHS_L_11-2199992.pdf> ERJ PB3, PB6 Series <https://www.mouser.com/datasheet/2/315/AOA0000C328-1530132.pdf> ERJ PA2, P03, PA3, P06, P08, P14 Series <https://www.mouser.com/datasheet/2/315/AOA0000C331-1141874.pdf> B20 Series <https://www.ohmite.com/assets/docs/res_200.pdf?r=false> TE Connectivity/Holsworthy RN73 Series <https://www.mouser.com/datasheet/2/418/4/NG_DS_1773270_M-604713.pdf> Vishay Dale D/CRCW e3 <https://www.mouser.com/datasheet/2/427/dcrcwe3-1762152.pdf> Ohmite B20 <https://www.ohmite.com/assets/docs/res_200.pdf?r=false>; DKPN: RHM75KAHTR-ND; MANUFACTURER: Rohm Semiconductor; MOPN: 755-KTR10EZPF7502; MPN: KTR10EZPF7502; POWER: 0.125W; RESISTANCE: 75k; TOLERANCE: 1%; VOLTAGE_CONTINUOUS: 96.8V; VOLTAGE_MAX: 400V
R9 R11 R21 R22 = HyTechDevices:RESISTOR_?_*: Resistor PWR163 Series <https://www.mouser.com/datasheet/2/54/pwr163-777985.pdf> AC Series <https://www.mouser.com/datasheet/2/447/Yageo_PYu_AC_51_RoHS_L_7_1714230-1874691.pdf> PU Series <https://www.mouser.com/datasheet/2/447/PYu-PU_51_RoHS_L_6-1504619.pdf> ERA Series <https://www.mouser.com/datasheet/2/315/AOA0000C307-1149632.pdf> PWR263 Series <https://www.mouser.com/datasheet/2/54/pwr263s_35-778069.pdf> KTR Series <https://www.mouser.com/datasheet/2/348/ROHM_S_A0011075115_1-2563276.pdf> RC Series <https://www.mouser.com/datasheet/2/447/Yageo_03_18_2021_PYu_RC_Group_51_RoHS_L_11-2199992.pdf> ERJ PB3, PB6 Series <https://www.mouser.com/datasheet/2/315/AOA0000C328-1530132.pdf> ERJ PA2, P03, PA3, P06, P08, P14 Series <https://www.mouser.com/datasheet/2/315/AOA0000C331-1141874.pdf> B20 Series <https://www.ohmite.com/assets/docs/res_200.pdf?r=false> TE Connectivity/Holsworthy RN73 Series <https://www.mouser.com/datasheet/2/418/4/NG_DS_1773270_M-604713.pdf> Vishay Dale D/CRCW e3 <https://www.mouser.com/datasheet/2/427/dcrcwe3-1762152.pdf> Ohmite B20 <https://www.ohmite.com/assets/docs/res_200.pdf?r=false>; DKPN: RHM365KAHTR-ND; MANUFACTURER: Rohm; MOPN: 755-KTR10EZPF3653; MPN: KTR10EZPF3653; POWER: 0.125W; RESISTANCE: 365k; TOLERANCE: 1%; VOLTAGE_CONTINUOUS: 213V; VOLTAGE_MAX: 350V
R10 R19 = HyTechDevices:RESISTOR_?_*: Resistor PWR163 Series <https://www.mouser.com/datasheet/2/54/pwr163-777985.pdf> AC Series <https://www.mouser.com/datasheet/2/447/Yageo_PYu_AC_51_RoHS_L_7_1714230-1874691.pdf> PU Series <https://www.mouser.com/datasheet/2/447/PYu-PU_51_RoHS_L_6-1504619.pdf> ERA Series <https://www.mouser.com/datasheet/2/315/AOA0000C307-1149632.pdf> PWR263 Series <https://www.mouser.com/datasheet/2/54/pwr263s_35-778069.pdf> KTR Series <https://www.mouser.com/datasheet/2/348/ROHM_S_A0011075115_1-2563276.pdf> RC Series <https://www.mouser.com/datasheet/2/447/Yageo_03_18_2021_PYu_RC_Group_51_RoHS_L_11-2199992.pdf> ERJ PB3, PB6 Series <https://www.mouser.com/datasheet/2/315/AOA0000C328-1530132.pdf> ERJ PA2, P03, PA3, P06, P08, P14 Series <https://www.mouser.com/datasheet/2/315/AOA0000C331-1141874.pdf> B20 Series <https://www.ohmite.com/assets/docs/res_200.pdf?r=false> TE Connectivity/Holsworthy RN73 Series <https://www.mouser.com/datasheet/2/418/4/NG_DS_1773270_M-604713.pdf> Vishay Dale D/CRCW e3 <https://www.mouser.com/datasheet/2/427/dcrcwe3-1762152.pdf> Ohmite B20 <https://www.ohmite.com/assets/docs/res_200.pdf?r=false>; DKPN: RHM1.00MAHTR-ND; MANUFACTURER: Rohm Semiconductor; MOPN: 755-KTR10EZPF1004; MPN: KTR10EZPF1004; POWER: 0.125W; RESISTANCE: 1M; TOLERANCE: 1%; VOLTAGE_CONTINUOUS: 353.5V; VOLTAGE_MAX: 400V
R12 = HyTechDevices:RESISTOR_?_*: Resistor PWR163 Series <https://www.mouser.com/datasheet/2/54/pwr163-777985.pdf> AC Series <https://www.mouser.com/datasheet/2/447/Yageo_PYu_AC_51_RoHS_L_7_1714230-1874691.pdf> PU Series <https://www.mouser.com/datasheet/2/447/PYu-PU_51_RoHS_L_6-1504619.pdf> ERA Series <https://www.mouser.com/datasheet/2/315/AOA0000C307-1149632.pdf> PWR263 Series <https://www.mouser.com/datasheet/2/54/pwr263s_35-778069.pdf> KTR Series <https://www.mouser.com/datasheet/2/348/ROHM_S_A0011075115_1-2563276.pdf> RC Series <https://www.mouser.com/datasheet/2/447/Yageo_03_18_2021_PYu_RC_Group_51_RoHS_L_11-2199992.pdf> ERJ PB3, PB6 Series <https://www.mouser.com/datasheet/2/315/AOA0000C328-1530132.pdf> ERJ PA2, P03, PA3, P06, P08, P14 Series <https://www.mouser.com/datasheet/2/315/AOA0000C331-1141874.pdf> B20 Series <https://www.ohmite.com/assets/docs/res_200.pdf?r=false> TE Connectivity/Holsworthy RN73 Series <https://www.mouser.com/datasheet/2/418/4/NG_DS_1773270_M-604713.pdf> Vishay Dale D/CRCW e3 <https://www.mouser.com/datasheet/2/427/dcrcwe3-1762152.pdf> Ohmite B20 <https://www.ohmite.com/assets/docs/res_200.pdf?r=false>; DKPN: 311-20.0KHRTR-ND; MANUFACTURER: Yageo; MOPN: 603-RC0603FR-0720KL; MPN: RC0603FR-0720KL; POWER: 0.1 W; RESISTANCE: 20k; TOLERANCE: 1%; VOLTAGE_CONTINUOUS: 44.72V; VOLTAGE_MAX: 75V
R13 R23 = HyTechDevices:RESISTOR_?_*: Resistor PWR163 Series <https://www.mouser.com/datasheet/2/54/pwr163-777985.pdf> AC Series <https://www.mouser.com/datasheet/2/447/Yageo_PYu_AC_51_RoHS_L_7_1714230-1874691.pdf> PU Series <https://www.mouser.com/datasheet/2/447/PYu-PU_51_RoHS_L_6-1504619.pdf> ERA Series <https://www.mouser.com/datasheet/2/315/AOA0000C307-1149632.pdf> PWR263 Series <https://www.mouser.com/datasheet/2/54/pwr263s_35-778069.pdf> KTR Series <https://www.mouser.com/datasheet/2/348/ROHM_S_A0011075115_1-2563276.pdf> RC Series <https://www.mouser.com/datasheet/2/447/Yageo_03_18_2021_PYu_RC_Group_51_RoHS_L_11-2199992.pdf> ERJ PB3, PB6 Series <https://www.mouser.com/datasheet/2/315/AOA0000C328-1530132.pdf> ERJ PA2, P03, PA3, P06, P08, P14 Series <https://www.mouser.com/datasheet/2/315/AOA0000C331-1141874.pdf> B20 Series <https://www.ohmite.com/assets/docs/res_200.pdf?r=false> TE Connectivity/Holsworthy RN73 Series <https://www.mouser.com/datasheet/2/418/4/NG_DS_1773270_M-604713.pdf> Vishay Dale D/CRCW e3 <https://www.mouser.com/datasheet/2/427/dcrcwe3-1762152.pdf> Ohmite B20 <https://www.ohmite.com/assets/docs/res_200.pdf?r=false>; DKPN: B20J1K5E-ND; MANUFACTURER: Ohmite; MOPN: 588-B20J1K5E; MPN: B20J1K5E; POWER: 20W; RESISTANCE: 1.5K; TOLERANCE: 5%; VOLTAGE_CONTINUOUS: 173V; VOLTAGE_MAX: 750V
R15 R18 = HyTechDevices:RESISTOR_?_*: Resistor PWR163 Series <https://www.mouser.com/datasheet/2/54/pwr163-777985.pdf> AC Series <https://www.mouser.com/datasheet/2/447/Yageo_PYu_AC_51_RoHS_L_7_1714230-1874691.pdf> PU Series <https://www.mouser.com/datasheet/2/447/PYu-PU_51_RoHS_L_6-1504619.pdf> ERA Series <https://www.mouser.com/datasheet/2/315/AOA0000C307-1149632.pdf> PWR263 Series <https://www.mouser.com/datasheet/2/54/pwr263s_35-778069.pdf> KTR Series <https://www.mouser.com/datasheet/2/348/ROHM_S_A0011075115_1-2563276.pdf> RC Series <https://www.mouser.com/datasheet/2/447/Yageo_03_18_2021_PYu_RC_Group_51_RoHS_L_11-2199992.pdf> ERJ PB3, PB6 Series <https://www.mouser.com/datasheet/2/315/AOA0000C328-1530132.pdf> ERJ PA2, P03, PA3, P06, P08, P14 Series <https://www.mouser.com/datasheet/2/315/AOA0000C331-1141874.pdf> B20 Series <https://www.ohmite.com/assets/docs/res_200.pdf?r=false> TE Connectivity/Holsworthy RN73 Series <https://www.mouser.com/datasheet/2/418/4/NG_DS_1773270_M-604713.pdf> Vishay Dale D/CRCW e3 <https://www.mouser.com/datasheet/2/427/dcrcwe3-1762152.pdf> Ohmite B20 <https://www.ohmite.com/assets/docs/res_200.pdf?r=false>; DKPN: P30KBDCT-ND; MANUFACTURER: Panasonic Electronic Components; MOPN: 667-ERA-3ARB303V; MPN: ERA-3ARB303V; POWER: 0.1W; RESISTANCE: 30k; TOLERANCE: 0.1%; VOLTAGE_CONTINUOUS: 54.77V; VOLTAGE_MAX: 75V
R20 R36 = HyTechDevices:RESISTOR_?_*: Resistor PWR163 Series <https://www.mouser.com/datasheet/2/54/pwr163-777985.pdf> AC Series <https://www.mouser.com/datasheet/2/447/Yageo_PYu_AC_51_RoHS_L_7_1714230-1874691.pdf> PU Series <https://www.mouser.com/datasheet/2/447/PYu-PU_51_RoHS_L_6-1504619.pdf> ERA Series <https://www.mouser.com/datasheet/2/315/AOA0000C307-1149632.pdf> PWR263 Series <https://www.mouser.com/datasheet/2/54/pwr263s_35-778069.pdf> KTR Series <https://www.mouser.com/datasheet/2/348/ROHM_S_A0011075115_1-2563276.pdf> RC Series <https://www.mouser.com/datasheet/2/447/Yageo_03_18_2021_PYu_RC_Group_51_RoHS_L_11-2199992.pdf> ERJ PB3, PB6 Series <https://www.mouser.com/datasheet/2/315/AOA0000C328-1530132.pdf> ERJ PA2, P03, PA3, P06, P08, P14 Series <https://www.mouser.com/datasheet/2/315/AOA0000C331-1141874.pdf> B20 Series <https://www.ohmite.com/assets/docs/res_200.pdf?r=false> TE Connectivity/Holsworthy RN73 Series <https://www.mouser.com/datasheet/2/418/4/NG_DS_1773270_M-604713.pdf> Vishay Dale D/CRCW e3 <https://www.mouser.com/datasheet/2/427/dcrcwe3-1762152.pdf> Ohmite B20 <https://www.ohmite.com/assets/docs/res_200.pdf?r=false>; RESISTANCE: DNP
R24 = HyTechDevices:RESISTOR_?_*: Resistor PWR163 Series <https://www.mouser.com/datasheet/2/54/pwr163-777985.pdf> AC Series <https://www.mouser.com/datasheet/2/447/Yageo_PYu_AC_51_RoHS_L_7_1714230-1874691.pdf> PU Series <https://www.mouser.com/datasheet/2/447/PYu-PU_51_RoHS_L_6-1504619.pdf> ERA Series <https://www.mouser.com/datasheet/2/315/AOA0000C307-1149632.pdf> PWR263 Series <https://www.mouser.com/datasheet/2/54/pwr263s_35-778069.pdf> KTR Series <https://www.mouser.com/datasheet/2/348/ROHM_S_A0011075115_1-2563276.pdf> RC Series <https://www.mouser.com/datasheet/2/447/Yageo_03_18_2021_PYu_RC_Group_51_RoHS_L_11-2199992.pdf> ERJ PB3, PB6 Series <https://www.mouser.com/datasheet/2/315/AOA0000C328-1530132.pdf> ERJ PA2, P03, PA3, P06, P08, P14 Series <https://www.mouser.com/datasheet/2/315/AOA0000C331-1141874.pdf> B20 Series <https://www.ohmite.com/assets/docs/res_200.pdf?r=false> TE Connectivity/Holsworthy RN73 Series <https://www.mouser.com/datasheet/2/418/4/NG_DS_1773270_M-604713.pdf> Vishay Dale D/CRCW e3 <https://www.mouser.com/datasheet/2/427/dcrcwe3-1762152.pdf> Ohmite B20 <https://www.ohmite.com/assets/docs/res_200.pdf?r=false>; DKPN: 13-RT0603BRD0739RLTR-ND; MANUFACTURER: Yageo; MOPN: 603-RT0603BRD0739RL; MPN: RT0603BRD0739RL; POWER: 0.1W; RESISTANCE: 39; TOLERANCE: 1%; VOLTAGE_CONTINUOUS: 1.97V; VOLTAGE_MAX: 75V
R25 R27 = HyTechDevices:RESISTOR_?_*: Resistor PWR163 Series <https://www.mouser.com/datasheet/2/54/pwr163-777985.pdf> AC Series <https://www.mouser.com/datasheet/2/447/Yageo_PYu_AC_51_RoHS_L_7_1714230-1874691.pdf> PU Series <https://www.mouser.com/datasheet/2/447/PYu-PU_51_RoHS_L_6-1504619.pdf> ERA Series <https://www.mouser.com/datasheet/2/315/AOA0000C307-1149632.pdf> PWR263 Series <https://www.mouser.com/datasheet/2/54/pwr263s_35-778069.pdf> KTR Series <https://www.mouser.com/datasheet/2/348/ROHM_S_A0011075115_1-2563276.pdf> RC Series <https://www.mouser.com/datasheet/2/447/Yageo_03_18_2021_PYu_RC_Group_51_RoHS_L_11-2199992.pdf> ERJ PB3, PB6 Series <https://www.mouser.com/datasheet/2/315/AOA0000C328-1530132.pdf> ERJ PA2, P03, PA3, P06, P08, P14 Series <https://www.mouser.com/datasheet/2/315/AOA0000C331-1141874.pdf> B20 Series <https://www.ohmite.com/assets/docs/res_200.pdf?r=false> TE Connectivity/Holsworthy RN73 Series <https://www.mouser.com/datasheet/2/418/4/NG_DS_1773270_M-604713.pdf> Vishay Dale D/CRCW e3 <https://www.mouser.com/datasheet/2/427/dcrcwe3-1762152.pdf> Ohmite B20 <https://www.ohmite.com/assets/docs/res_200.pdf?r=false>; DKPN: 10-ERJ-UP3F2001VTR-ND; MANUFACTURER: Panasonic Electronic Components; MOPN: 667-ERJ-UP3F2001V; MPN: ERJ-UP3F2001V; POWER: 0.25W; RESISTANCE: 2k; TOLERANCE: 1%; VOLTAGE_CONTINUOUS: 22.36V; VOLTAGE_MAX: 150V
R30 = HyTechDevices:RESISTOR_?_*: Resistor PWR163 Series <https://www.mouser.com/datasheet/2/54/pwr163-777985.pdf> AC Series <https://www.mouser.com/datasheet/2/447/Yageo_PYu_AC_51_RoHS_L_7_1714230-1874691.pdf> PU Series <https://www.mouser.com/datasheet/2/447/PYu-PU_51_RoHS_L_6-1504619.pdf> ERA Series <https://www.mouser.com/datasheet/2/315/AOA0000C307-1149632.pdf> PWR263 Series <https://www.mouser.com/datasheet/2/54/pwr263s_35-778069.pdf> KTR Series <https://www.mouser.com/datasheet/2/348/ROHM_S_A0011075115_1-2563276.pdf> RC Series <https://www.mouser.com/datasheet/2/447/Yageo_03_18_2021_PYu_RC_Group_51_RoHS_L_11-2199992.pdf> ERJ PB3, PB6 Series <https://www.mouser.com/datasheet/2/315/AOA0000C328-1530132.pdf> ERJ PA2, P03, PA3, P06, P08, P14 Series <https://www.mouser.com/datasheet/2/315/AOA0000C331-1141874.pdf> B20 Series <https://www.ohmite.com/assets/docs/res_200.pdf?r=false> TE Connectivity/Holsworthy RN73 Series <https://www.mouser.com/datasheet/2/418/4/NG_DS_1773270_M-604713.pdf> Vishay Dale D/CRCW e3 <https://www.mouser.com/datasheet/2/427/dcrcwe3-1762152.pdf> Ohmite B20 <https://www.ohmite.com/assets/docs/res_200.pdf?r=false>; DKPN: P20340TR-ND; MANUFACTURER: Panasonic Electronic Components; MOPN: 667-ERJ-PB3D3301V; MPN: ERJ-PB3D3301V; POWER: 0.3W; RESISTANCE: 3.3k; TOLERANCE: 0.5%; VOLTAGE_CONTINUOUS: 25.69V; VOLTAGE_MAX: 150
R32 = HyTechDevices:RESISTOR_?_*: Resistor PWR163 Series <https://www.mouser.com/datasheet/2/54/pwr163-777985.pdf> AC Series <https://www.mouser.com/datasheet/2/447/Yageo_PYu_AC_51_RoHS_L_7_1714230-1874691.pdf> PU Series <https://www.mouser.com/datasheet/2/447/PYu-PU_51_RoHS_L_6-1504619.pdf> ERA Series <https://www.mouser.com/datasheet/2/315/AOA0000C307-1149632.pdf> PWR263 Series <https://www.mouser.com/datasheet/2/54/pwr263s_35-778069.pdf> KTR Series <https://www.mouser.com/datasheet/2/348/ROHM_S_A0011075115_1-2563276.pdf> RC Series <https://www.mouser.com/datasheet/2/447/Yageo_03_18_2021_PYu_RC_Group_51_RoHS_L_11-2199992.pdf> ERJ PB3, PB6 Series <https://www.mouser.com/datasheet/2/315/AOA0000C328-1530132.pdf> ERJ PA2, P03, PA3, P06, P08, P14 Series <https://www.mouser.com/datasheet/2/315/AOA0000C331-1141874.pdf> B20 Series <https://www.ohmite.com/assets/docs/res_200.pdf?r=false> TE Connectivity/Holsworthy RN73 Series <https://www.mouser.com/datasheet/2/418/4/NG_DS_1773270_M-604713.pdf> Vishay Dale D/CRCW e3 <https://www.mouser.com/datasheet/2/427/dcrcwe3-1762152.pdf> Ohmite B20 <https://www.ohmite.com/assets/docs/res_200.pdf?r=false>; DKPN: RT0603BRE0775KL-ND; MANUFACTURER: Yageo; MOPN: 603-RT0603BRE0775KL; MPN: RT0603BRE0775KL; POWER: 0.1W; RESISTANCE: 75k; TOLERANCE: 0.1%; VOLTAGE_CONTINUOUS: 75V; VOLTAGE_MAX: 75V
R34 = HyTechDevices:RESISTOR_?_*: Resistor PWR163 Series <https://www.mouser.com/datasheet/2/54/pwr163-777985.pdf> AC Series <https://www.mouser.com/datasheet/2/447/Yageo_PYu_AC_51_RoHS_L_7_1714230-1874691.pdf> PU Series <https://www.mouser.com/datasheet/2/447/PYu-PU_51_RoHS_L_6-1504619.pdf> ERA Series <https://www.mouser.com/datasheet/2/315/AOA0000C307-1149632.pdf> PWR263 Series <https://www.mouser.com/datasheet/2/54/pwr263s_35-778069.pdf> KTR Series <https://www.mouser.com/datasheet/2/348/ROHM_S_A0011075115_1-2563276.pdf> RC Series <https://www.mouser.com/datasheet/2/447/Yageo_03_18_2021_PYu_RC_Group_51_RoHS_L_11-2199992.pdf> ERJ PB3, PB6 Series <https://www.mouser.com/datasheet/2/315/AOA0000C328-1530132.pdf> ERJ PA2, P03, PA3, P06, P08, P14 Series <https://www.mouser.com/datasheet/2/315/AOA0000C331-1141874.pdf> B20 Series <https://www.ohmite.com/assets/docs/res_200.pdf?r=false> TE Connectivity/Holsworthy RN73 Series <https://www.mouser.com/datasheet/2/418/4/NG_DS_1773270_M-604713.pdf> Vishay Dale D/CRCW e3 <https://www.mouser.com/datasheet/2/427/dcrcwe3-1762152.pdf> Ohmite B20 <https://www.ohmite.com/assets/docs/res_200.pdf?r=false>; DKPN: P20936TR-ND; MANUFACTURER: Panasonic Electronic Components; MOPN: 667-ERJ-PB6B1004V; MPN: ERJ-PB6B1004V; POWER: 0.25W; RESISTANCE: 1M; TOLERANCE: 0.1%; VOLTAGE_CONTINUOUS: 150V; VOLTAGE_MAX: 150V
R35 = HyTechDevices:RESISTOR_?_*: Resistor PWR163 Series <https://www.mouser.com/datasheet/2/54/pwr163-777985.pdf> AC Series <https://www.mouser.com/datasheet/2/447/Yageo_PYu_AC_51_RoHS_L_7_1714230-1874691.pdf> PU Series <https://www.mouser.com/datasheet/2/447/PYu-PU_51_RoHS_L_6-1504619.pdf> ERA Series <https://www.mouser.com/datasheet/2/315/AOA0000C307-1149632.pdf> PWR263 Series <https://www.mouser.com/datasheet/2/54/pwr263s_35-778069.pdf> KTR Series <https://www.mouser.com/datasheet/2/348/ROHM_S_A0011075115_1-2563276.pdf> RC Series <https://www.mouser.com/datasheet/2/447/Yageo_03_18_2021_PYu_RC_Group_51_RoHS_L_11-2199992.pdf> ERJ PB3, PB6 Series <https://www.mouser.com/datasheet/2/315/AOA0000C328-1530132.pdf> ERJ PA2, P03, PA3, P06, P08, P14 Series <https://www.mouser.com/datasheet/2/315/AOA0000C331-1141874.pdf> B20 Series <https://www.ohmite.com/assets/docs/res_200.pdf?r=false> TE Connectivity/Holsworthy RN73 Series <https://www.mouser.com/datasheet/2/418/4/NG_DS_1773270_M-604713.pdf> Vishay Dale D/CRCW e3 <https://www.mouser.com/datasheet/2/427/dcrcwe3-1762152.pdf> Ohmite B20 <https://www.ohmite.com/assets/docs/res_200.pdf?r=false>; DKPN: P20904TR-ND; MANUFACTURER: Panasonic Electronic Components; MOPN: 667-ERJ-PB6B5233V; MPN: ERJ-PB6B5233V; POWER: 0.25W; RESISTANCE: 523k; TOLERANCE: 0.1%; VOLTAGE_CONTINUOUS: 150V; VOLTAGE_MAX: 150V
R37-R39 = HyTechDevices:RESISTOR_?_*: Resistor PWR163 Series <https://www.mouser.com/datasheet/2/54/pwr163-777985.pdf> AC Series <https://www.mouser.com/datasheet/2/447/Yageo_PYu_AC_51_RoHS_L_7_1714230-1874691.pdf> PU Series <https://www.mouser.com/datasheet/2/447/PYu-PU_51_RoHS_L_6-1504619.pdf> ERA Series <https://www.mouser.com/datasheet/2/315/AOA0000C307-1149632.pdf> PWR263 Series <https://www.mouser.com/datasheet/2/54/pwr263s_35-778069.pdf> KTR Series <https://www.mouser.com/datasheet/2/348/ROHM_S_A0011075115_1-2563276.pdf> RC Series <https://www.mouser.com/datasheet/2/447/Yageo_03_18_2021_PYu_RC_Group_51_RoHS_L_11-2199992.pdf> ERJ PB3, PB6 Series <https://www.mouser.com/datasheet/2/315/AOA0000C328-1530132.pdf> ERJ PA2, P03, PA3, P06, P08, P14 Series <https://www.mouser.com/datasheet/2/315/AOA0000C331-1141874.pdf> B20 Series <https://www.ohmite.com/assets/docs/res_200.pdf?r=false> TE Connectivity/Holsworthy RN73 Series <https://www.mouser.com/datasheet/2/418/4/NG_DS_1773270_M-604713.pdf> Vishay Dale D/CRCW e3 <https://www.mouser.com/datasheet/2/427/dcrcwe3-1762152.pdf> Ohmite B20 <https://www.ohmite.com/assets/docs/res_200.pdf?r=false>; DKPN: RHM330KAHTR-ND; MANUFACTURER: Rohm Semiconductor; MOPN: 755-KTR10EZPF3303; MPN: KTR10EZPF3303; POWER: 0.125W; RESISTANCE: 330k; TOLERANCE: 1%; VOLTAGE_CONTINUOUS: 203.1V; VOLTAGE_MAX: 400V
R40 R41 = HyTechDevices:RESISTOR_?_*: Resistor PWR163 Series <https://www.mouser.com/datasheet/2/54/pwr163-777985.pdf> AC Series <https://www.mouser.com/datasheet/2/447/Yageo_PYu_AC_51_RoHS_L_7_1714230-1874691.pdf> PU Series <https://www.mouser.com/datasheet/2/447/PYu-PU_51_RoHS_L_6-1504619.pdf> ERA Series <https://www.mouser.com/datasheet/2/315/AOA0000C307-1149632.pdf> PWR263 Series <https://www.mouser.com/datasheet/2/54/pwr263s_35-778069.pdf> KTR Series <https://www.mouser.com/datasheet/2/348/ROHM_S_A0011075115_1-2563276.pdf> RC Series <https://www.mouser.com/datasheet/2/447/Yageo_03_18_2021_PYu_RC_Group_51_RoHS_L_11-2199992.pdf> ERJ PB3, PB6 Series <https://www.mouser.com/datasheet/2/315/AOA0000C328-1530132.pdf> ERJ PA2, P03, PA3, P06, P08, P14 Series <https://www.mouser.com/datasheet/2/315/AOA0000C331-1141874.pdf> B20 Series <https://www.ohmite.com/assets/docs/res_200.pdf?r=false> TE Connectivity/Holsworthy RN73 Series <https://www.mouser.com/datasheet/2/418/4/NG_DS_1773270_M-604713.pdf> Vishay Dale D/CRCW e3 <https://www.mouser.com/datasheet/2/427/dcrcwe3-1762152.pdf> Ohmite B20 <https://www.ohmite.com/assets/docs/res_200.pdf?r=false>; DKPN: P20155CT-ND; MANUFACTURER: Panasonic Electronic Components; MOPN: 667-ERJ-PB3B4122V; MPN: ERJ-PB3B4122V; POWER: 0.2W; RESISTANCE: 41.2k; TOLERANCE: 0.1%; VOLTAGE_CONTINUOUS: 150V; VOLTAGE_MAX: 200V
T1 = HyTechDevices:TRANSFORMER(3W): Sumida 3 Winding Flyback Transformer https://www.mouser.com/datasheet/2/390/LT8316_PQ2620_Datasheet_ver_3_20190825-2199694.pdf; MANUFACTURER: Sumida; MOPN: 851-11328-T061; MPN: 11328-T061
U1 = HyTechDevices:VOLTAGE_REGULATOR_?_*: Voltage Regulators LDL1117S50R Datasheet <https://www.mouser.com/datasheet/2/389/dm00366442-1799212.pdf> NCP785AH120T1G <https://www.mouser.com/datasheet/2/308/NCP785A_D-1812704.pdf> LMS8117A Datasheet <https://www.ti.com/lit/ds/symlink/lms8117a.pdf?HQS> ST732M50R Datasheet <https://www.mouser.com/datasheet/2/389/st732-1830546.pdf> LM2937IMPX-10/NOPB Datasheet <https://www.ti.com/lit/ds/symlink/lm2937.pdf>; DKPN: LM2937IMPX-10/NOPBDKR-ND; MANUFACTURER: Texas Instruments; MOPN: 926-LM2937IMP-10NOPB; MPN: LM2937IMPX-10/NOPB
U2 = HyTechDevices:LT8316: LT8316 560VIN Micropower No-Opto Isolated Flyback Controller Datasheet <https://www.mouser.com/datasheet/2/609/LT8316-1545981.pdf>; DKPN: 505-LT8316EFE#PBF-ND; MANUFACTURER: Analog Devices; MOPN: 584-LT8316EFE#PBF; MPN: LT8316EFE#PBF
U3 U4 = HyTechDevices:ISO224*: ISO224*: Isolated precision amplifier ISO224A: Low-Grade ISO224B: High-Grade ISO224* Datasheet <https://www.ti.com/lit/ds/symlink/iso224.pdf?HQS=dis-dk-null-digikeymode-dsf-pf-null-wwe&ts=1625423566252&ref_url=https%253A%252F%252Fwww.ti.com%252Fgeneral%252Fdocs%252Fsuppproductinfo.tsp%253FdistId%253D10%2526gotoUrl%253Dhttps%253A%252F%252Fwww.ti.com%252Flit%252Fgpn%252Fiso224>; DKPN: 296-52316-1-ND; MANUFACTURER: Texas Instruments; MOPN: 595-ISO224BDWVR; MPN: ISO224BDWVR
U5 = HyTechDevices:RELAY_SOLIDSTATE_NO_*: AQY214EHA Normally Open Solid State Relay Datasheet <https://www.datasheetq.com/datasheet-download/287654/1/Panasonic/AQY214EH> Crydom CMX Series Solid State Normally Open Relay Datasheet <https://www.mouser.com/datasheet/2/657/cmx_series_dc_pcb_mount-1370813.pdf> AB38S-Q Datasheet <https://comus-intl.com/wp-content/uploads/2016/09/AB38S-Q.pdf> CPC1020NTR Datasheet <https://www.mouser.com/datasheet/2/240/CPC1020N-1546163.pdf>; DKPN: 1835-1216-ND; MANUFACTURER: Comus International; MPN: AB38S-Q; VOLTAGE: 600V
U10 = HyTechDevices:LTC6994-*: Analog Devices Inc Delay IC 1us to 33.6s Datasheet <https://www.mouser.com/datasheet/2/609/LTC6994_1_6994_2-1270043.pdf>

## Board
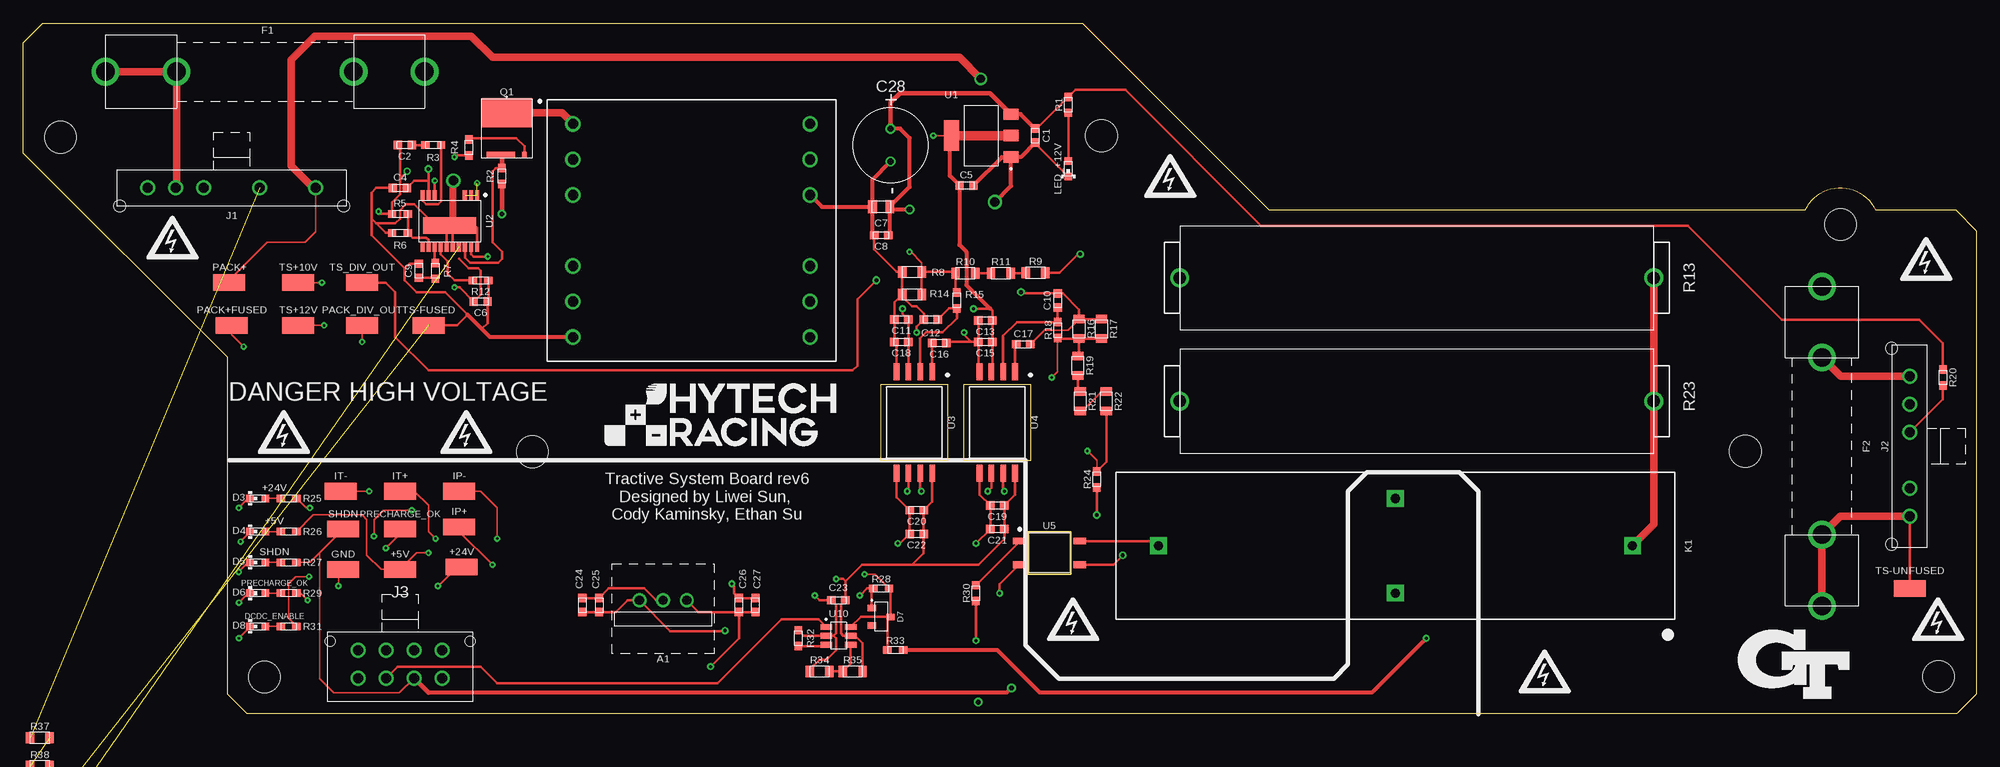
[diagram p3: board, top side]
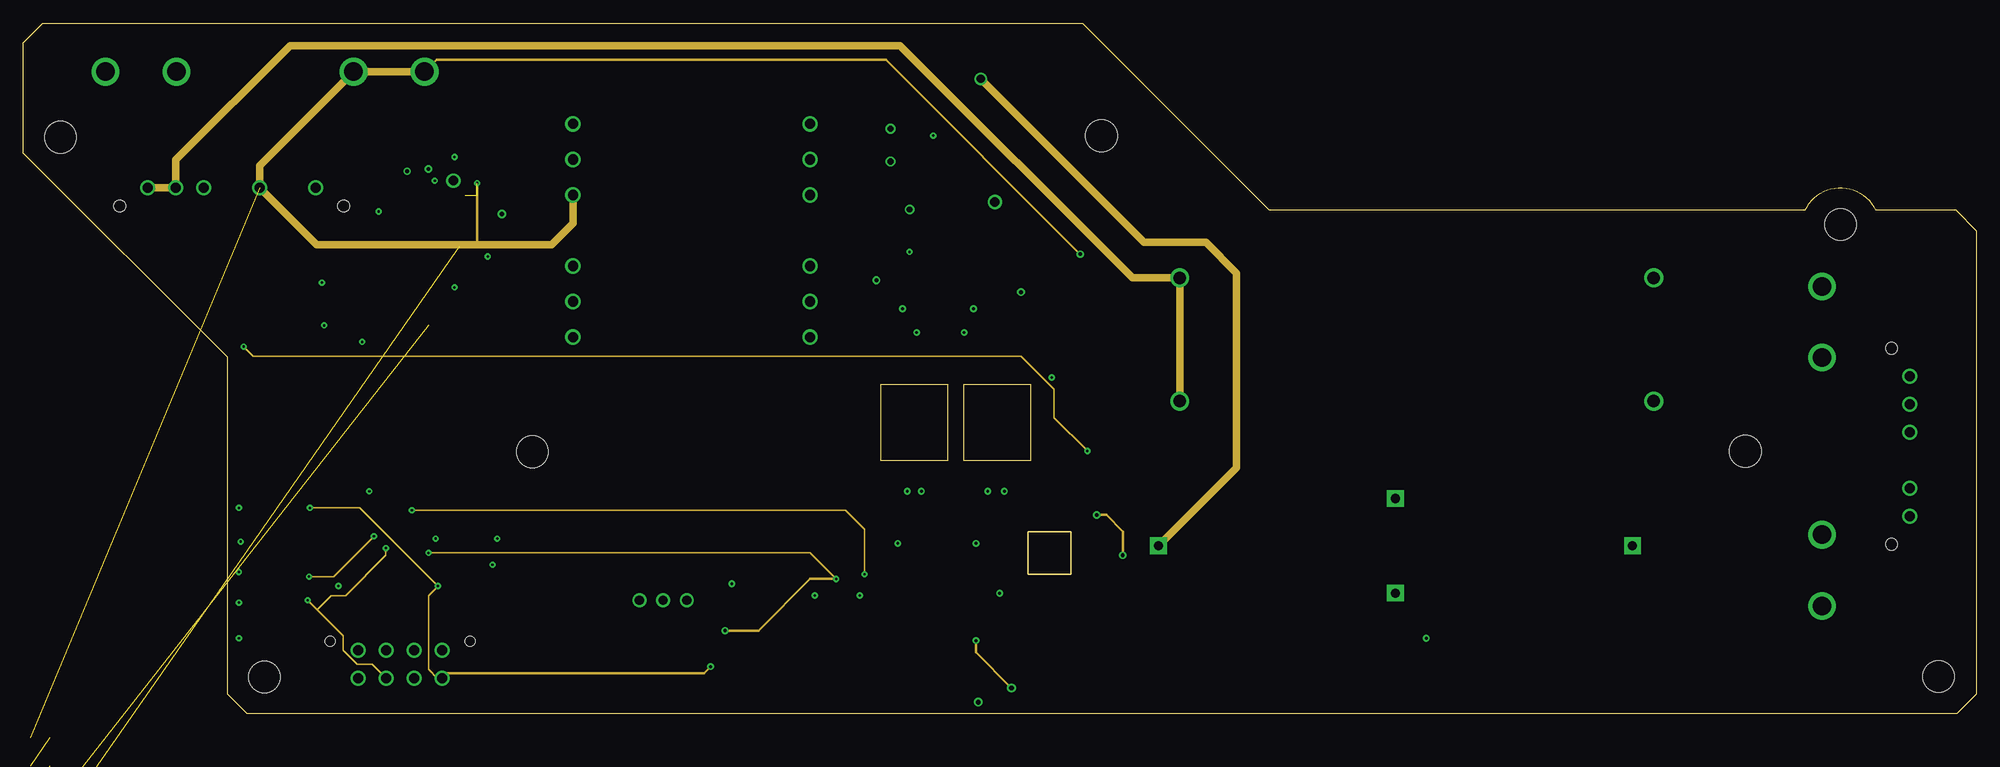
[diagram p4: board, inner layer Route2]
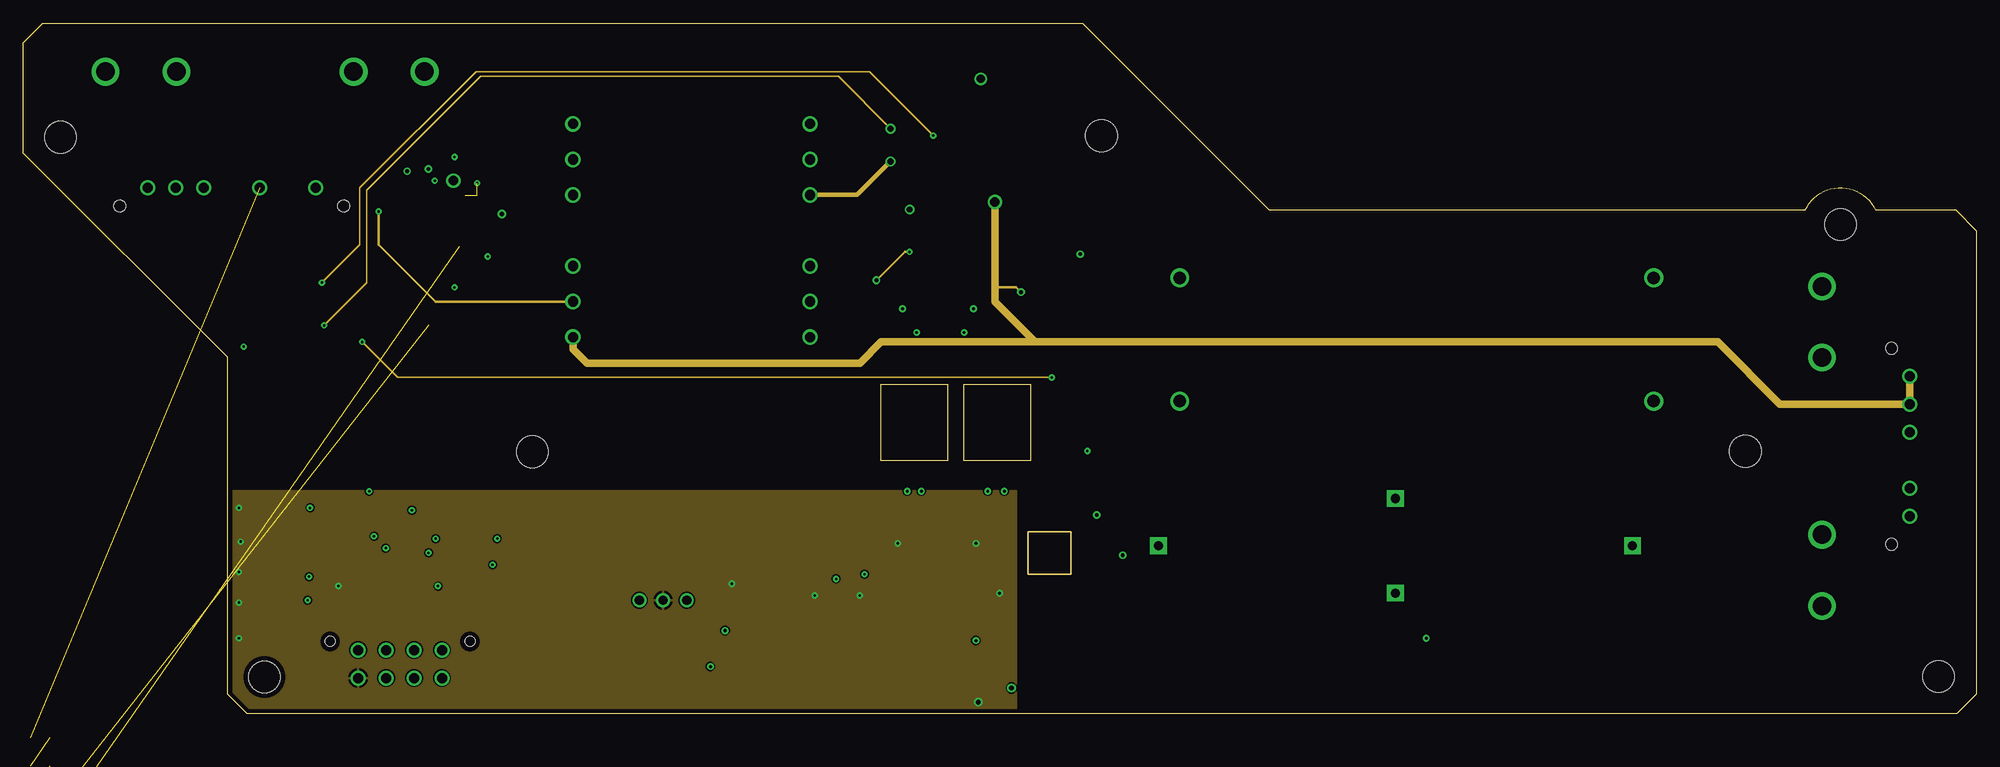
[diagram p5: board, inner layer Route15]
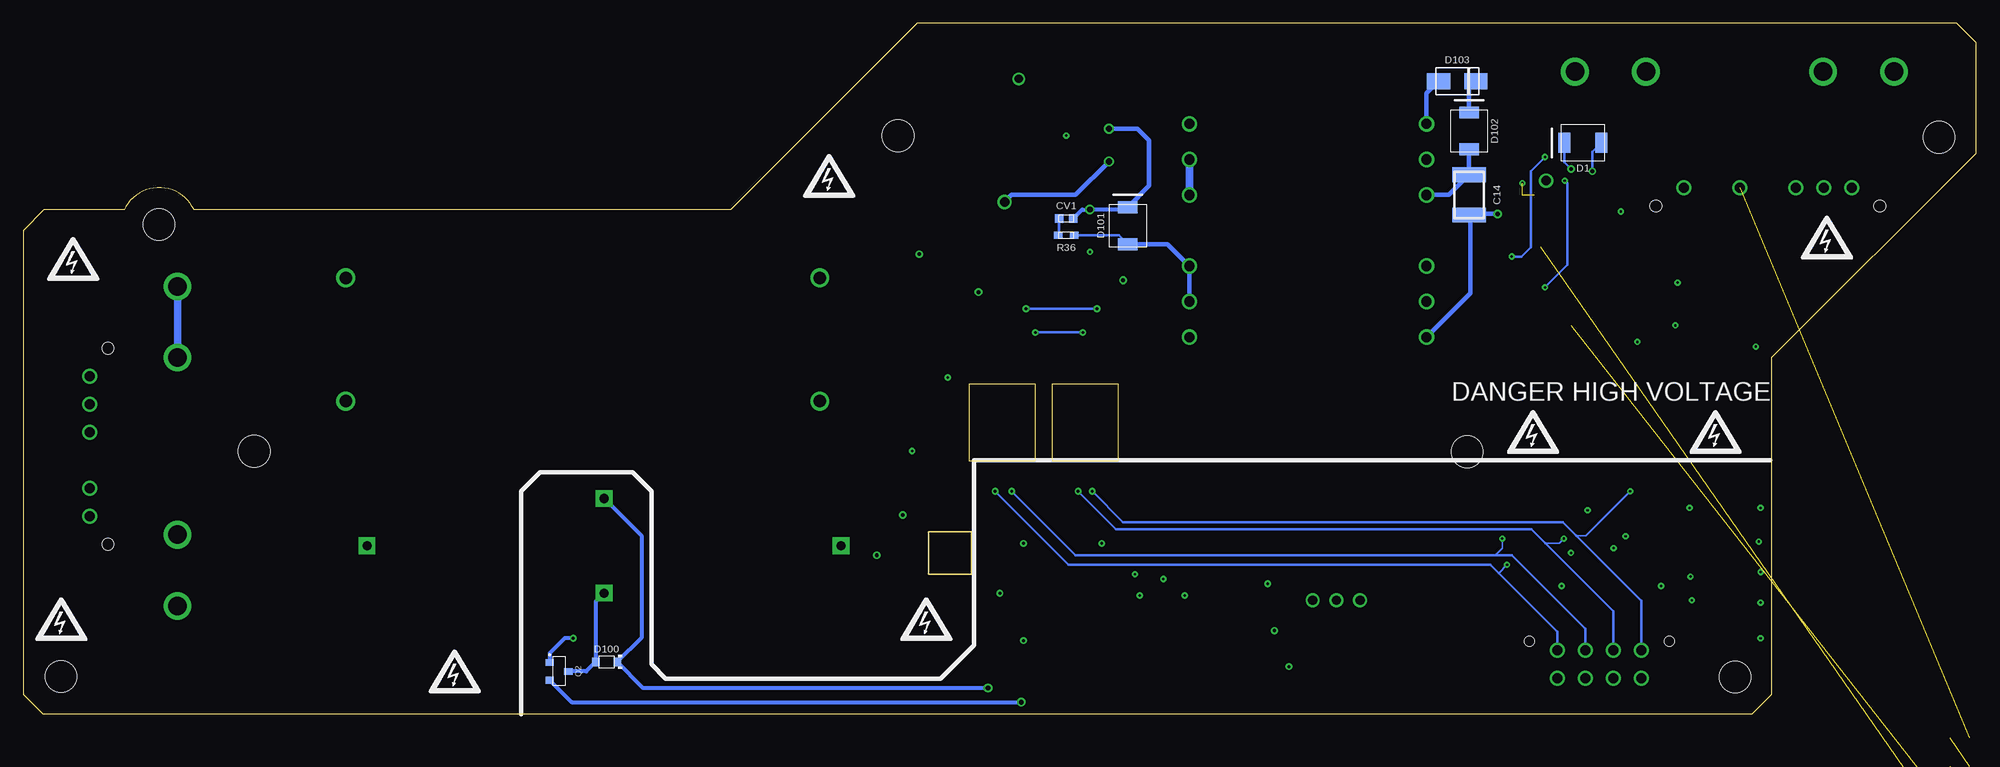
[diagram p6: board, bottom side, seen from below]

Size 209.3 x 74 mm. Coordinates in mm from the lower left corner, seen from the top.
Outline: 2.1,74 113.5,74 133.5,54 191,54 arc-130 198.5,54 207.1,54 209.3,51.8 209.3,2.1 207.2,0 24,0 21.9,2.1 21.9,38.2 0,60.1 0,71.9 2.1,74
Copper layers (1+2*15+16): Top 0.035mm / dielectric 0.2mm / Route2 0.0175mm / dielectric 1.065mm / Route15 0.0175mm / dielectric 0.2mm / Bottom 0.035mm
Design rules "HyTech Default (4 Layer)": minimum track width 6mil, minimum drill 10mil, track to track 6mil, track to pad 6mil, pad to pad 6mil, via to via 20mil, smd to smd 6mil, copper to edge 20mil, drill to drill 21mil, minimum pad ring 8mil, minimum via ring 8mil, stop-mask expansion 3mil, vias tented up to drill 30mil, thermal gap 10mil

### Footprints (pad centres in the part's own frame; a part is rotated, then mirrored left to right if it is on the bottom)
MOUNTING_M3 = hole 3.4: 0,0
5015 = smd 3.429 x 1.778: 1 0,0
OKI-78SR = drill 0.991: 1 -2.54,0; 2 0,0; 3 2.54,0
0603-CAP = smd 0.9 x 0.9: 1 -0.75,0; 2 0.75,0
0805-CAP = smd 0.95 x 1.4: 1 -0.925,0; 2 0.925,0
1812-CAP = smd 1.6 x 3.6: 1 -2.15,0; 2 2.15,0
A759KR = drill 0.65: MINUS 1.75,0; PLUS -1.75,0
DO-214AA = smd 1.27 x 2.1: 1 -1.98,0; 2 1.98,0
0603-LED = smd 0.8 x 0.8: 1 -0.825,0; 2 0.825,0
SOT-23 = smd 0.711 x 0.889: 1 -0.94,-1.003; 2 0.94,-1.003; 3 0,1.003
SOD-323 = smd 0.8 x 0.9: A -1.15,0; C 1.15,0
SMA = smd 2.5 x 1.7: A -2,0; C 2,0
122 = drill 1.981: 1 -17.107,0; 2 -9.474,0; 3 9.5,0; 4 17.107,0
MOLEX_MICROFIT_PTH_VERTICAL_07_SINGLE_SPACED = drill 1.067: 1 -8.992,0; 2 -5.994,0; 3 -2.997,0; 4 2.997,0; 5 8.992,0 | hole 1.27: 12.002,-1.956; -12.002,-1.956
MOLEX_MICROFIT_PTH_VERTICAL_06_SINGLE_SPACED = drill 1.067: 1 -7.493,0; 2 -4.496,0; 3 -1.499,0; 4 4.496,0; 5 7.493,0 | hole 1.27: 10.503,-1.956; -10.503,-1.956
MOLEX_MICROFIT_PTH_VERTICAL_08_DUAL = drill 1.067: 1 4.496,-2.997; 2 1.499,-2.997; 3 -1.499,-2.997; 4 -4.496,-2.997; 5 4.496,0; 6 1.499,0; 7 -1.499,0; 8 -4.496,0 | hole 1.067: 7.493,0.94; -7.493,0.94
D = drill 1 pad 1.778 square: 1 -25.4,0; 2 25.4,0; 3 0,5.08; 4 0,-5.08
POWERFLAT5X6 = smd 5.4 x 3.07: D 0,1.69 | smd 0.5 x 0.72: G 1.905,-2.835 | smd 3.04 x 0.73: S -0.635,-2.835
0603-RES = smd 0.9 x 0.8: 1 -0.85,0; 2 0.85,0
0805-RES = smd 0.9 x 1.2: 1 -1.05,0; 2 1.05,0
B20-SHORTENED = drill 1.35: 1 25.4,0; 2 -25.4,0
PQ2620 = drill 1.1: 1 -12.7,11.43; 2 -12.7,7.62; 3 -12.7,3.81; 4 -12.7,-3.81; 5 -12.7,-7.62; 6 -12.7,-11.43; 7 12.7,-11.43; 8 12.7,-7.62; 9 12.7,-3.81; 10 12.7,3.81; 11 12.7,7.62; 12 12.7,11.43
SOT-223 = smd 1.2 x 1.6: 1 -2.3,-3.2; 2 0,-3.2; 3 2.3,-3.2 | smd 3.3 x 1.6: 4 0,3.2
TSSOP-20(16) = smd 0.45 x 1.05: 1 -2.925,-2.775; 2 -2.275,-2.775; 3 -1.625,-2.775; 8 1.625,-2.775; 9 2.275,-2.775; 10 2.925,-2.775; 11 2.925,2.775; 12 2.275,2.775; 13 1.625,2.775; 14 0.975,2.775; 15 0.325,2.775; 16 -0.325,2.775; 17 -0.975,2.775; 18 -1.625,2.775; 19 -2.275,2.775; 20 -2.925,2.775 | smd 5.68 x 1.78: THERMAL 0,0.47
SOIC-08(WIDE,0.295")-AIRGAP = smd 0.6 x 1.8: 1 -1.905,-5.45; 2 -0.635,-5.45; 3 0.635,-5.45; 4 1.905,-5.45; 5 1.905,5.45; 6 0.635,5.45; 7 -0.635,5.45; 8 -1.905,5.45
SOP-04-AIRGAP = smd 0.7 x 1.3: 1 -1.27,-3.25; 2 1.27,-3.25; 3 1.27,3.25; 4 -1.27,3.25
SOT-23-6 = smd 0.62 x 1.22: 1 -0.95,-1.31; 2 0,-1.31; 3 0.95,-1.31; 4 -0.95,1.31; 5 0,1.31; 6 0.95,1.31

### Placement (x,y rotation side)
$$U$1  [HV_MEDIUM]  15.99,51.04 0 top
$$U$2  [MOUNTING_M3]  115.55,61.95 0 top
$$U$3  [MOUNTING_M3]  4,61.8 0 top
$$U$4  [HV_MEDIUM]  122.93,57.64 0 top
$$U$5  [MOUNTING_M3]  194.75,52.45 0 top
$$U$6  [HV_MEDIUM]  203.95,48.75 0 top
$$U$8  [HV_MEDIUM]  27.93,30.21 0 top
$$U$104  [HV_MEDIUM]  27.93,30.21 0 bottom
$$U$105  [HV_MEDIUM]  203.95,48.75 0 bottom
$$U$106  [HV_MEDIUM]  122.93,57.64 0 bottom
$$U$107  [HV_MEDIUM]  15.99,51.04 0 bottom
+5V  40.38,15.48 0 top
+24V  46.98,15.73 0 top
A1  68.57,12.18 180 top
C1  108.45,61.96 270 top
C2  40.88,60.95 0 top
C4  40.38,56.37 180 top
C5  101.08,56.63 0 top
C6  49.01,44.18 0 top
C7  91.94,54.34 180 top
C8  91.94,51.29 180 top
C9  42.41,47.48 90 top
C10  110.86,44.31 90 top
C11  94.1,42.28 180 top
C12  97.27,42.28 180 top
C13  103.11,42.15 180 top
C14  54.35,55.61 270 bottom
C15  103.11,39.86 180 top
C16  98.16,39.74 0 top
C17  107.18,39.61 0 top
C18  94.1,39.86 180 top
C19  104.38,22.34 180 top
C20  95.75,21.83 180 top
C21  104.38,19.8 180 top
C22  95.75,19.29 180 top
C23  87.37,12.18 180 top
C24  59.93,11.67 90 top
C25  61.71,11.67 90 top
C26  76.7,11.67 90 top
C27  78.48,11.67 90 top
C28  92.95,60.95 270 top
CV1  97.53,53.07 180 bottom
D1  42.15,61.2 180 bottom
D3  25.14,23.1 0 top
D4  25.14,19.54 0 top
D5  25.14,16.24 0 top
D6  25.14,12.94 0 top
D7  91.94,10.4 270 top
D8  25.14,9.38 0 top
D100  146.8,5.57 0 bottom
D101  90.92,52.31 90 bottom
D102  54.35,62.47 90 bottom
D103  55.62,67.8 0 bottom
F1  25.9,68.82 0 top
F2  192.78,28.69 90 top
GND  34.28,15.48 0 top
IP+  46.73,20.05 0 top
IP-  46.73,23.86 0 top
IT+  40.38,23.86 0 top
IT-  34.03,23.86 0 top
J1  22.34,56.37 0 top
J2  202.17,28.69 270 top
J3  40.38,6.84 0 top
K1  147.06,18.02 180 top
LED_+12V  112,58.41 90 top
PACK+  22.09,46.21 0 top
PACK+FUSED  22.34,41.64 0 top
PACK_DIV_OUT  36.31,41.64 0 top
PRECHARGE_OK  40.38,19.8 0 top
Q1  51.81,62.72 0 top
Q2  151.88,4.56 270 bottom
R1  112,65.26 90 top
R2  51.3,57.64 90 top
R3  43.93,60.95 180 top
R4  47.74,60.69 90 top
R5  40.38,53.58 180 top
R6  40.38,51.55 0 top
R7  44.19,47.48 90 top
R8  95.24,47.36 0 top
R9  108.49,47.27 0 top
R10  100.95,47.23 0 top
R11  104.77,47.23 0 top
R12  49.01,46.47 180 top
R13  149.34,46.72 0 top
R14  95.24,44.94 0 top
R15  100.07,44.31 270 top
R16  113.15,41.26 270 top
R17  115.56,41.26 270 top
R18  110.86,41.13 90 top
R19  113.02,37.32 270 top
R20  205.73,36.05 270 top
R21  113.27,33.51 270 top
R22  116.07,33.51 270 top
R23  149.34,33.51 0 top
R24  115.05,25.13 90 top
R25  28.44,23.1 0 top
R26  28.44,19.54 180 top
R27  28.44,16.24 0 top
R28  91.94,13.45 0 top
R29  28.44,12.94 0 top
R30  102.1,12.94 90 top
R31  28.44,9.38 0 top
R32  83.05,8.11 270 top
R33  93.46,6.84 0 top
R34  85.33,4.56 0 top
R35  88.89,4.56 0 top
R36  97.53,51.29 180 bottom
R37  1.77,-2.55 0 top
R38  1.77,-5.6 0 top  (outside the outline)
R39  1.77,-8.65 0 top  (outside the outline)
R40  5.07,-8.4 0 top  (outside the outline)
R41  1.51,-11.44 0 top  (outside the outline)
SHDN  34.28,19.8 0 top
T1  71.62,51.8 0 top
TS+10V  29.45,46.21 0 top
TS+12V  29.45,41.64 0 top
TS-FUSED  43.42,41.64 0 top
TS-UNFUSED  202.17,13.45 0 top
TS_DIV_OUT  36.31,46.21 0 top
U1  102.67,61.97 90 top
U2  45.71,52.82 180 top
U3  95.49,31.23 180 top
U4  104.38,31.23 180 top
U5  109.97,17.26 270 top
U10  87.37,8.37 270 top
U$7  [DANGER_HIGH_VOLTAGE]  39.11,34.53 0 top
U$9  [HV_MEDIUM]  47.49,30.21 0 top
U$10  [LOGO_HYTECH_MEDIUM]  62.27,28.76 0 top
U$11  [MOUNTING_M3]  184.55,28.15 0 top
U$12  [MOUNTING_M3]  54.55,28.1 0 top
U$13  [HV_MEDIUM]  205.22,10.15 0 top
U$14  [HV_MEDIUM]  112.51,10.15 0 top
U$15  [HV_MEDIUM]  163.06,4.56 0 top
U$16  [MOUNTING_M3]  205.25,4 0 top
U$17  [MOUNTING_M3]  25.85,3.95 0 top
U$18  [LOGO_GT_MEDIUM]  189.73,5.32 0 top
U$100  [HV_MEDIUM]  163.06,4.56 0 bottom
U$101  [HV_MEDIUM]  112.51,10.15 0 bottom
U$102  [HV_MEDIUM]  205.22,10.15 0 bottom
U$103  [HV_MEDIUM]  47.49,30.21 0 bottom

### Tracks (layer width: path | path; a pad name or v marks a point on that pad's centre or on a via)
+5V  (via drill 0.25, 0.35)
  Top 0.152: v43.42,17.26 42.15,17.26 +5V.1 38.34,15.48 36.82,17 36.82,20.81 36.31,21.32 31.07,21.32 R26.1
  Top 0.254: R35.2 89.94,7.57 89.14,8.37 U10.5 87.87,8.37 87.62,8.62 87.62,11.68 C23.1 88.12,14.2 88.13,14.21 | U3.8 97.4,22.73 C20.1 C22.1 96.5,17.25 95.24,15.99 | 95.24,15.99 89.91,15.99 88.13,14.21 | 95.24,15.99 102.35,15.99 105.15,18.78 105.15,19.79 C21.1 C19.1 106.29,23.49 U4.8 | v87.11,14.46 87.87,14.46 88.13,14.21 | C24.1 C25.1 63.5,10.92 64.76,12.18 A1.3 69.33,8.88 75.14,8.88 v75.2,8.94
  Route2 0.152: v43.42,17.26 84.32,17.26 v87.11,14.46
  Route2 0.254: v75.2,8.94 78.79,8.94 84.32,14.46 v87.11,14.46
+24V  (via drill 0.25, 0.3)
  Top 0.152: v44.44,13.7 46.47,15.73 +24V.1 | R25.2 30.3,22.08 v30.72,22.08
  Top 0.254: C26.1 76.7,8.11 v73.65,5.07 | C26.1 72.37,10.92 A1.1 | C26.1 C27.1
  Route2 0.152: v30.72,22.08 36.06,22.08 v44.44,13.7 43.42,12.69 43.42,4.79 44.36,3.85 J3.1
  Route2 0.254: v73.65,5.07 72.94,4.36 45.38,4.36 J3.1
DCDC_ENABLE  (via drill 0.25)
  Top 0.152: v90.16,14.97 91.26,14.97 R28.2 | v41.65,21.83 38.6,21.83 37.58,20.81 v37.58,19.04 | v30.62,14.72 29.2,14.72 28.44,13.96 28.44,10.23 R31.2
  Top 0.254: D7.3 92.61,10.07 R33.1 | D7.3 92.94,13.3 R28.2 | D7.3 89.76,10.4 U10.4
  Route2 0.152: v41.65,21.83 88.13,21.83 90.16,19.8 v90.16,14.97 | v37.58,19.04 33.26,14.72 v30.62,14.72
GND  (via drill 0.25, 0.3, 0.51)
  Top 0.152: D3.1 24.12,23.1 v23.1,22.08 | D6.1 24.12,12.94 v23.1,11.92 | D5.1 24.12,16.24 v23.1,15.22 | D4.1 23.3,18.53 v23.3,18.47 | GND.1 33.77,14.97 v33.77,13.7 | D8.1 24.31,9.32 v23.1,8.11
  Top 0.254: 86.86,8.37 U10.2 83.64,8.37 R32.1 | 86.86,8.37 87.11,8.62 87.11,11.68 C23.2 85.33,12.18 v84.83,12.69 | 86.86,8.37 87.11,8.11 87.11,6.84 86.1,5.83 85.33,5.83 84.28,4.78 R34.1 | D7.1 90.94,13.3 R28.1 90.41,13.45 v89.65,12.69 | v75.94,13.96 76.19,13.7 76.19,12.93 C26.2 C27.2 | v93.72,18.27 93.98,18.27 C22.2 C20.2 93.59,23.24 U3.5 | v102.1,18.27 v102.11,18.27 C21.2 C19.2 102.48,23.49 U4.5 | v104.64,12.94 104.64,13.9 U5.2 | C24.2 C25.2 62.74,13.45 66.54,13.45 67.81,12.18 A1.2
  Bottom 0.406: Q2.2 150.52,1.26 v102.35,1.26
  pour Route15: 21.88,23.86 106.42,23.86 106.42,-0.25 21.88,-0.25
IP+  (via drill 0.25, 0.3)
  Top 0.152: v50.28,15.99 46.73,19.54 IP+.1
  Top 0.254: U4.7 105.02,23.99 v105.15,23.86
  Bottom 0.152: 51.17,15.1 v50.28,15.99
  Bottom 0.254: v105.15,23.86 97.27,15.99 52.06,15.99 51.17,15.1 44.87,8.8 J3.5
IP-  (via drill 0.25, 0.3)
  Top 0.152: v50.79,18.78 50.79,22.08 49.01,23.86 IP-.1
  Top 0.254: U4.6 103.75,24.24 v103.37,23.86
  Bottom 0.152: 51.55,17 50.79,17.77 v50.79,18.78
  Bottom 0.254: v103.37,23.86 96.51,17 51.55,17 49.77,17 41.88,9.11 J3.6
IT+  (via drill 0.25, 0.3)
  Top 0.152: v44.19,18.78 43.42,19.54 43.42,22.34 41.9,23.86 IT+.1
  Top 0.254: U3.7 96.13,23.99 v96.26,23.86
  Bottom 0.152: 46.19,18.3 44.67,18.3 v44.19,18.78
  Bottom 0.254: v96.26,23.86 92.19,19.8 47.69,19.8 46.19,18.3 38.88,10.98 J3.7
IT-  (via drill 0.25, 0.3)
  Top 0.152: v37.07,23.86 IT-.1
  Top 0.254: U3.6 94.86,23.99 v94.73,23.86
  Bottom 0.152: 42.84,19.11 41.82,19.11 v37.07,23.86
  Bottom 0.254: v94.73,23.86 91.43,20.56 44.29,20.56 42.84,19.11 35.88,12.15 J3.8
LED+
  Top 0.254: J2.3 205.73,33.74 R20.2
N$1
  Top 0.254: R22.1 115.63,34.56 113.53,32.46 R21.2
N$2
  Top 0.152: R27.1 D5.2
N$3  (via drill 0.3)
  Top 0.406: v150.36,8.11 144.52,2.27 108.96,2.27 104.38,6.84 R33.2
  Bottom 0.406: v150.36,8.11 151.29,8.11 152.89,6.51 Q2.1
N$4
  Top 0.254: R9.1 107.4,47.23 R11.2
N$5
  Bottom 0.508: D103.C 54.35,67.07 D102.2
N$6
  Top 0.254: R11.1 R10.2
N$7
  Top 0.254: R19.2 113.02,34.82 R21.1
N$8
  Top 0.813: T1.1 57.74,64.41 Q1.D
  Bottom 0.508: D103.A 58.92,66.5 T1.1
N$9  (via drill 0.38)
  Top 0.254: C4.1 41.89,57.14 43.43,57.14 U2.9 43.43,58.4 v43.42,58.41
  Bottom 0.254: v43.42,58.41 44.13,59.12 D1.2
N$10
  Top 0.254: R32.2 85.9,7.26 U10.3
N$11
  Top 0.254: R34.2 R35.1 88.68,5.39 U10.6
N$12
  Top 0.254: R5.1 R6.2 41.73,51.04 43.19,51.04 43.42,50.81 43.42,50.06 U2.12
N$13
  Top 0.254: R3.2 C2.2
N$14
  Top 0.254: R3.1 44.78,54.94 44.44,54.6 43.17,54.6 42.78,54.98 U2.10
N$15
  Top 0.254: R7.2 44.08,48.44 U2.13
N$16
  Top 0.254: U2.14 44.73,49.28 45.5,48.52 45.5,47.19 46.22,46.47 R12.2
N$17  (via drill 0.25, 0.38)
  Top 0.254: v38.09,53.83 38.34,53.58 R5.2 39.53,54.85 40.38,55.7 40.38,56.88 40.38,57.39 | 40.38,57.39 40.38,60.7 C2.1 | 40.38,57.39 v41.14,58.15
  Route15 0.254: T1.5 44.19,44.18 38.09,50.28 v38.09,53.83
  Bottom 0.254: v41.14,58.15 41.14,60.24 D1.1
N$18
  Top 0.254: C9.1 44.09,46.73 R7.1
N$19  (via drill 0.25)
  Top 0.254: U2.8 44.09,55.6 v44.09,57.14 | v46.22,45.71 46.74,45.71 C6.1 49.01,44.93 49.01,47.48 48.76,47.74 47.74,47.74 46.68,48.8
  Bottom 0.254: v44.09,57.14 43.8,56.85 43.8,48.12 v46.22,45.71
N$20  (via drill 0.25)
  Top 0.254: U2.19 47.98,49.27 48.25,49.01 v49.77,49.01 | v46.22,59.68 46.38,59.84 R4.1
  Bottom 0.254: v49.77,49.01 48.76,49.01 47.74,50.02 47.74,58.15 v46.22,59.68
N$21
  Bottom 0.254: D101.1 91.89,51.29 R36.1
  Bottom 0.508: T1.8 T1.9 86.66,50.33 D101.1
N$22
  Top 0.152: R29.1 D6.2
N$23
  Top 0.254: R1.1 LED_+12V.2
N$24
  Top 0.152: R31.1 D8.2
N$25
  Top 0.152: R25.1 D3.2
N$26
  Top 0.254: R2.2 50.62,58.49 50.28,58.15 50.28,50.53 51.3,49.52 51.3,48.75 50.89,48.35 47.89,48.35 47.33,48.91 U2.18
  Top 0.508: Q1.S 51.3,59.76 R2.2
N$27
  Top 0.254: Q1.G 53.71,60.82 52.82,61.71 47.91,61.71 R4.2
N$28
  Bottom 0.254: R36.2 98.28,51.39 CV1.2
N$29  (1 unrouted)
N$30
  Top 0.152: R26.2 D4.2
N$31  (1 unrouted)
N$32  (3 unrouted)
N$40
  Bottom 0.406: K1.3 147.95,12.04 D100.A 148.97,4.56 Q2.3
N$50
  Top 0.813: R13.1 R23.1 174.74,20.31 K1.1
N$53
  Top 0.254: R30.2 106.72,18.41 U5.1
N$57  (via drill 0.38)
  Top 0.254: U5.3 116.83,15.99 v117.85,17 | v115.05,21.32 R24.1
  Route2 0.254: v117.85,17 117.85,19.54 116.07,21.32 v115.05,21.32
N$62
  Top 0.254: C10.1 R18.2 106.5,41.98 105.02,40.5 U4.2
N$63
  Top 0.254: U3.2 96.13,40.25 96.76,40.88 98.54,40.88 100.07,42.4 R15.2 99.2,43.46 C12.1
N$69
  Top 0.254: C17.1 106.29,39.47 U4.1
N$73
  Top 0.254: U3.1 97.4,39.73 C16.1
PACK+  (via drill 0.89)
  Top 0.152: J1.5 31.33,56.12 31.33,51.65 30.22,50.53 26.15,50.53 22.09,46.47 PACK+.1
  Top 0.254: U5.4 121.15,18.53 K1.2
  Top 0.813: v102.61,68.06 100.32,70.34 50.28,70.34 48,72.63 31.23,72.63 28.69,70.09 28.69,58.76 31.33,56.12
  Route2 0.813: v102.61,68.06 120.13,50.53 126.74,50.53 130.04,47.23 130.04,26.4 K1.2
PACK+FUSED  (via drill 0.25)
  Top 0.152: R24.2 115.05,27.16 v114.04,28.18 | v23.61,39.36 22.34,40.63 PACK+FUSED.1
  Top 0.254: R22.2 116.07,27 R24.2
  Route2 0.152: v114.04,28.18 110.48,31.74 110.48,34.78 106.92,38.34 24.63,38.34 v23.61,39.36
PACK_DIV_OUT  (via drill 0.25)
  Top 0.152: R18.1 110.86,36.69 v110.23,36.05 | v36.31,39.86 PACK_DIV_OUT.1
  Top 0.254: R17.2 R16.2 | R19.1 113.15,38.5 R16.2 | R16.2 110.93,40.21 R18.1
  Route15 0.152: v36.31,39.86 40.12,36.05 v110.23,36.05
PRECHARGE_OK  (via drill 0.25)
  Top 0.152: PRECHARGE_OK.1 40.38,19.29 v38.85,17.77 | v30.47,12.18 29.71,12.94 R29.2
  Top 0.254: U10.1 85.23,10.15 81.27,10.15 74.41,3.29 50.79,3.29 49.01,5.07 40.1,5.07 J3.3
  Route2 0.152: 31.49,11.16 v30.47,12.18 | v38.85,17.77 38.85,17 34.53,12.69 33.01,12.69 31.49,11.16 | 31.49,11.16 34.28,8.37 34.28,6.84 35.8,5.32 37.4,5.32 J3.3
SHDN  (via drill 0.3, 0.51)
  Top 0.152: 31.74,17.26 31.74,3.8 33.26,2.27 40.3,2.27 J3.2 | 31.74,17.26 30.72,16.24 R27.2 | 31.74,17.26 SHDN.1
  Top 0.254: v102.1,7.86 R30.1
  Top 0.406: 43.45,2.27 105.4,2.27 v105.91,2.78
  Top 0.508: 43.45,2.27 J3.2
  Route2 0.254: v105.91,2.78 102.1,6.59 v102.1,7.86
  Bottom 0.406: v105.91,2.78 142.86,2.78 D100.C 142.99,8.23 142.99,19.04 K1.4
TS+10V  (via drill 0.25, 0.3)
  Top 0.152: U1.4 99.3,61.97 97.54,61.97 v97.53,61.96 | v31.99,46.21 TS+10V.1
  Top 0.254: U4.3 103.86,36.79 C15.1 C13.1 103.86,43.18 103.62,43.42 v101.84,43.42 | U3.3 94.85,36.69 C18.1 C11.1 94.22,42.9 v94.22,43.42
  Top 0.406: 103.62,43.42 101.08,45.96 101.08,49.52 100.33,50.27 C5.1 99.3,57.66 99.3,61.97
  Top 1.016: U1.4 U1.2
  Route15 0.152: v97.53,61.96 90.67,68.82 48.5,68.82 36.06,56.37 36.06,50.28 v31.99,46.21
  Bottom 0.254: v94.22,43.42 v101.84,43.42
TS+12V  (via drill 0.25, 0.61)
  Top 0.152: v32.25,41.64 TS+12V.1
  Top 0.254: R20.1 205.73,39.7 203.19,42.24 188.46,42.24 178.39,52.31 132.67,52.31 118.1,66.88 112.77,66.88 R1.2 108.6,62.71 C1.1
  Top 0.406: C1.1 106.89,64.27 U1.3 | C7.1 94.99,56.47 94.99,61.71 93.99,62.71 92.97,62.71 C28.PLUS | C7.1 92.86,51.47 C8.1 | v94.99,54.04 93.17,54.04 C7.1
  Top 0.508: U1.3 103.6,66.53 93.97,66.53 92.95,65.52 C28.PLUS
  Route15 0.152: v32.25,41.64 36.82,46.21 36.82,56.12 49.01,68.31 87.37,68.31 92.95,62.72 C28.PLUS
  Bottom 0.254: D101.2 91.18,54.04
  Bottom 0.406: CV1.1 95.81,54.04 v94.99,54.04 91.18,54.04
  Bottom 0.508: D101.2 88.64,56.58 88.64,61.45 89.91,62.72 92.93,62.72 C28.PLUS
TS+FUSED  (via drill 0.25, 0.38)  (4 unrouted)
  Top 0.254: v113.27,49.26 113.05,49.26 111.06,47.27 R9.2 | v48.63,56.88
  Route2 0.254: v113.27,49.26 92.45,70.09 44.27,70.09 F1.4 | v48.63,56.88 48.63,50.41 48.5,50.28
  Route2 0.813: T1.3 58.92,52.56 56.63,50.28 48.5,50.28 31.44,50.28 J1.4 25.34,58.76 F1.3 F1.4
  Bottom 0.508: T1.3 56.5,55.61 C14.1 D102.1
TS+UNFUSED
  Top 0.813: F1.1 F1.2 16.42,56.45 J1.2
  Route2 0.813: J1.1 J1.2 16.35,59.37 28.59,71.61 93.97,71.61 118.86,46.72 R13.2 R23.2
TS-FUSED  (via drill 0.3, 0.41, 0.51, 1.02)  (2 unrouted)
  Top 0.152: C17.2 109.45,41.13 111.97,41.13 R16.1
  Top 0.254: C15.2 102.36,36.79 U4.4 | C13.2 C15.2 | C16.2 99.04,39.86 101.59,39.86 | 101.59,39.86 C15.2 | U3.4 93.59,39.62 C18.2 C11.2 93.35,44.1 R14.1 | C8.2 91.19,49.78 91.18,49.77 93.59,47.36 R8.1 R14.1 | R14.1 94.19,44.72 95.24,43.67 95.75,43.67 96.52,42.9 C12.2 95.75,41.5 v95.75,40.88 | R17.1 R16.1 113.15,43.33 111.41,45.06 C10.2 107.06,45.06 v106.92,45.2 | 101.59,39.86 100.83,40.63 v100.83,40.88 | 49.14,41.26 49.76,41.88 C6.2 49.86,44.28 R12.1 | U2.20 48.62,50.06 48.62,52.08 48.35,52.35 U2.THERMAL | 37.84,52.56 37.33,53.07 | 37.33,53.07 37.33,55.87 37.84,56.37 C4.2 | U2.15 45.38,52.02 45.69,52.33 | 45.69,52.33 U2.THERMAL | U2.16 46.03,52.02 U2.THERMAL | 40.88,47.74 40.88,46.47 42.15,45.2 45.2,45.2 47.61,42.79 46.47,41.64 TS-FUSED.1 | 40.88,47.74 41.39,48.25 42.4,48.25 C9.2 | 45.69,52.33 43.7,52.33 43.7,52.8 41.9,54.6 41,54.6 40.37,53.97 40.37,53.07 39.87,52.56 37.84,52.56 | 37.33,53.07 37.33,51.29 40.88,47.74 | 37.84,52.56 38.85,51.55 R6.1 | LED_+12V.1 108.45,61.14 C1.2
  Top 0.406: C1.2 106.91,59.67 U1.1 | C8.2 91.01,51.47 C7.2 | T1.6 50.03,40.37 49.14,41.26 47.61,42.79 | T1.10 85.59,54.34 C7.2 | U1.1 104.88,59.67 C5.2 | v104.13,54.85 105.87,56.59 U1.1 | C28.MINUS 91.01,57.26 C7.2
  Top 0.508: R2.1 v51.3,53.58
  Top 0.762: U2.THERMAL 46.09,52.73 v46.09,57.14
  Top 0.813: J2.1 194.78,36.18 F2.3
  Route15 0.254: v106.92,45.2 106.42,45.71 104.13,45.71
  Route15 0.508: C28.MINUS 89.37,55.61 T1.10
  Route15 0.813: J2.1 J2.2 188.28,33.18 181.6,39.86 108.45,39.86 | 108.45,39.86 91.94,39.86 89.65,37.58 60.44,37.58 58.92,39.1 T1.6 | 108.45,39.86 104.13,44.18 104.13,45.71 v104.13,54.85
  Bottom 0.254: v100.83,40.88 v95.75,40.88
  Bottom 0.406: 54.23,53.58 C14.2
  Bottom 0.508: v51.3,53.58 54.23,53.58 54.23,45.06 T1.6 | v104.13,54.85 103.37,55.61 96.53,55.61 92.95,59.18 C28.MINUS
  Bottom 0.813: T1.11 T1.10 | F2.3 F2.4
TS-UNFUSED
  Top 0.254: TS-UNFUSED.1 J2.5
  Top 0.813: J2.5 194.76,21.2 F2.2 F2.1
TS_DIV_OUT  (via drill 0.25, 0.41)
  Top 0.152: v94.99,49.52 95.15,49.52 96.29,48.37 R8.2 | 38.09,46.21 TS_DIV_OUT.1
  Top 0.254: R14.2 R8.2 99.78,47.36 R10.1 99.91,45.32 R15.1 | v91.43,46.47 89.4,44.44 89.4,37.32 88.89,36.82 43.42,36.82 39.87,40.37 39.87,45.2 38.85,46.21 38.09,46.21
  Route15 0.254: v94.99,49.52 94.48,49.52 v91.43,46.47

### Text on the board
tPlace: +24V | Tractive System Board rev6 / Designed by Liwei Sun, / Cody Kaminsky, Ethan Su | +5V | SHDN | PRECHARGE_OK | DCDC_ENABLE